# EAGLE design Sphagnum_mom_rev_a (EAGLE 9.6.2)
AUTOR: Renato; CODIGO: 0; DESENHO: Renato; EQUIPAMENTO: Alimentador Caes e Gatos; MODELO: JM01; REV: A
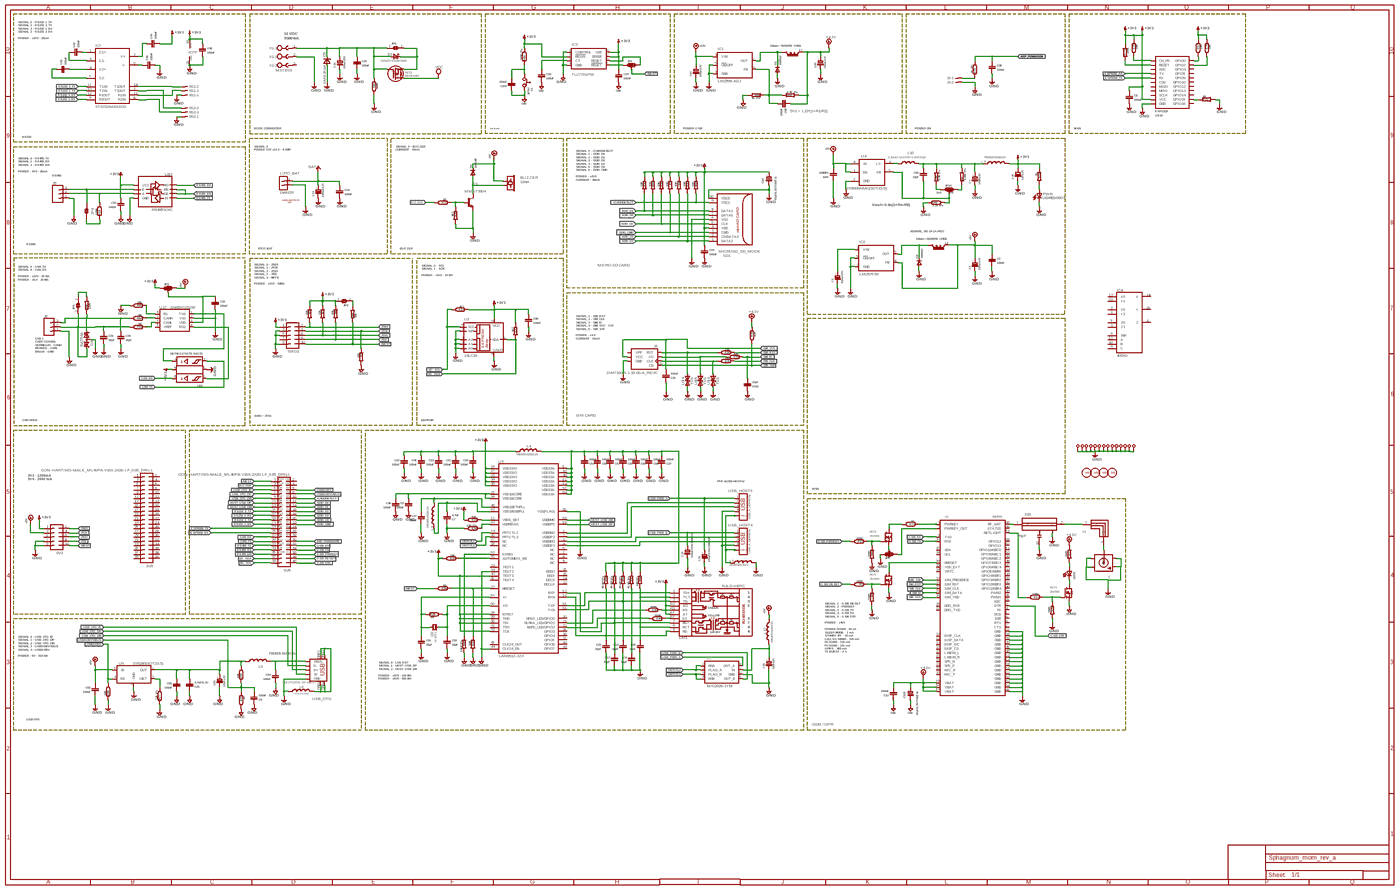
[diagram p0: schematic, sheet 1, overview]
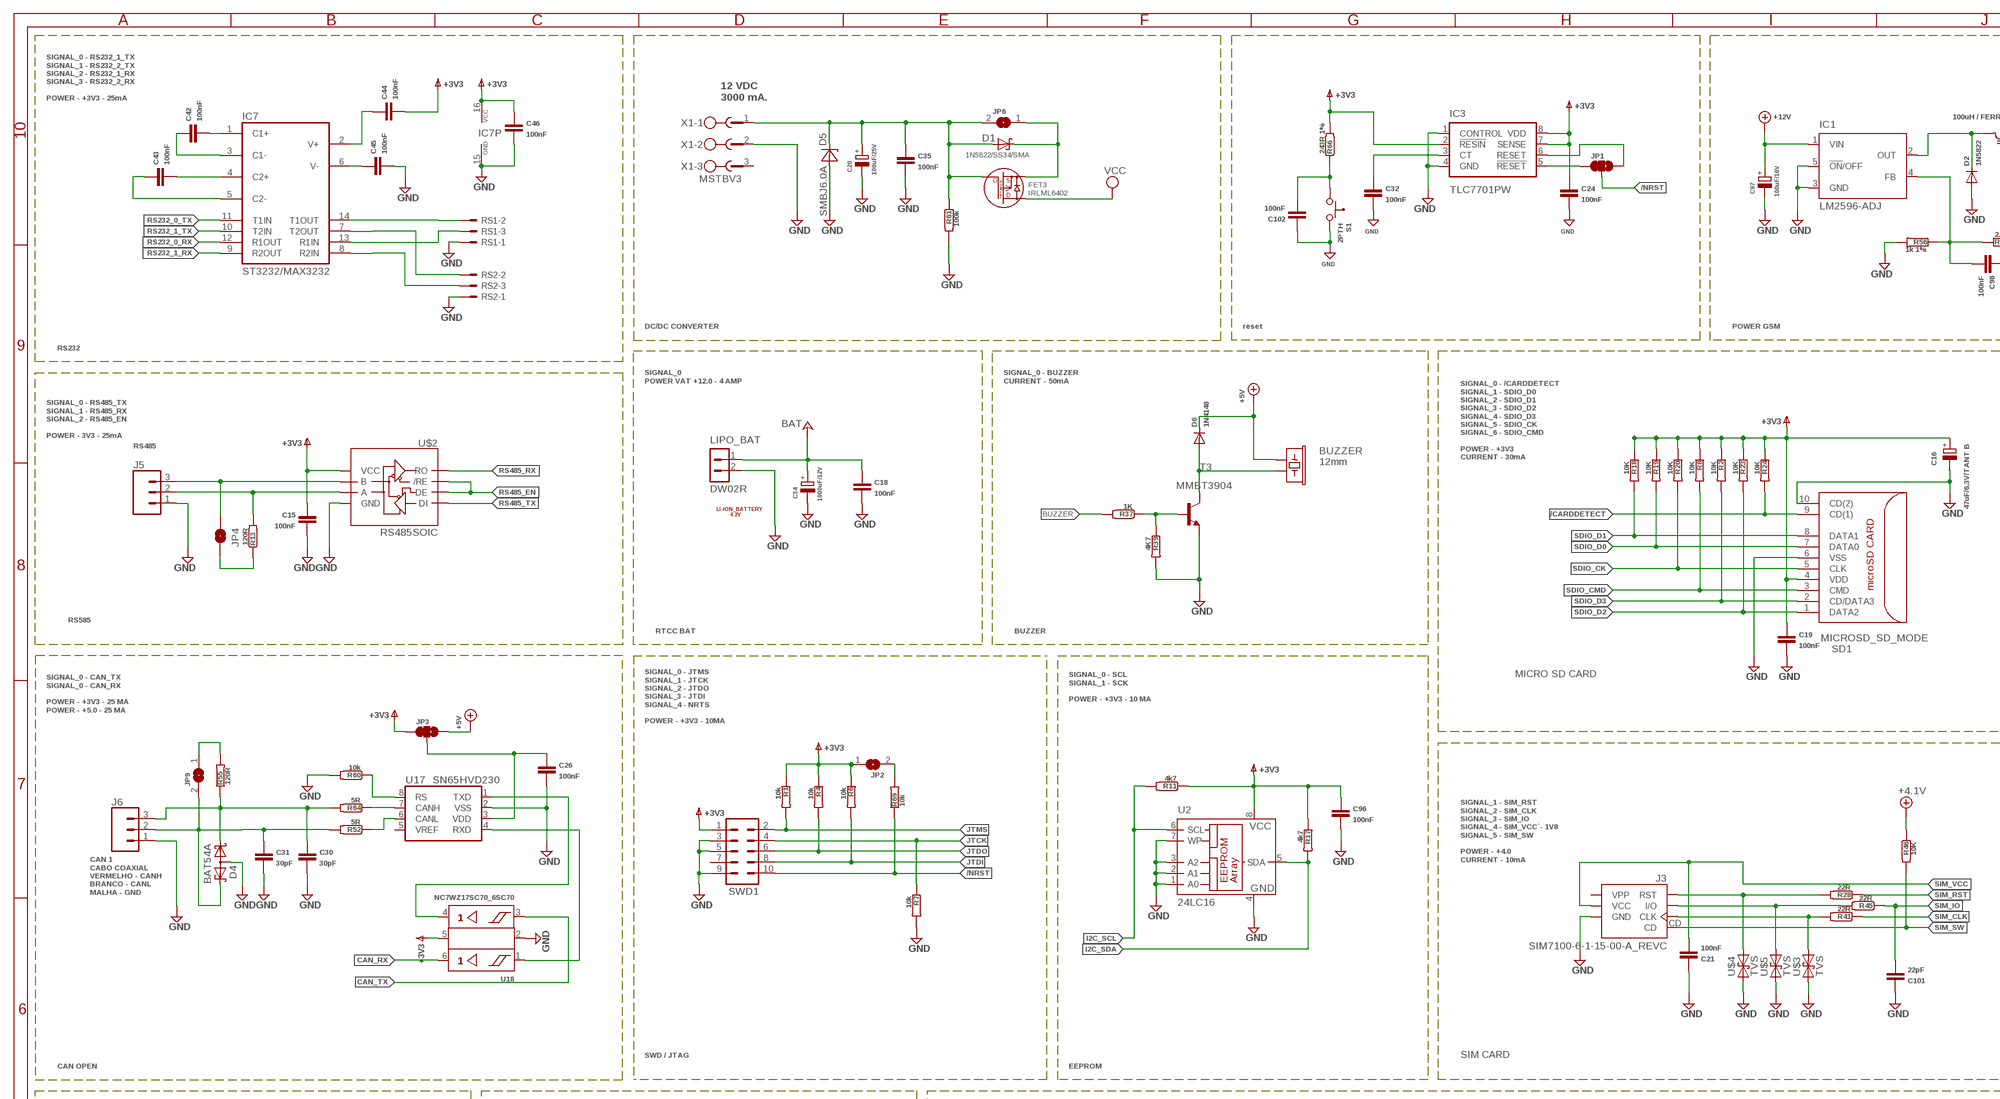
[diagram p1: schematic, sheet 1, part 1 of 4]
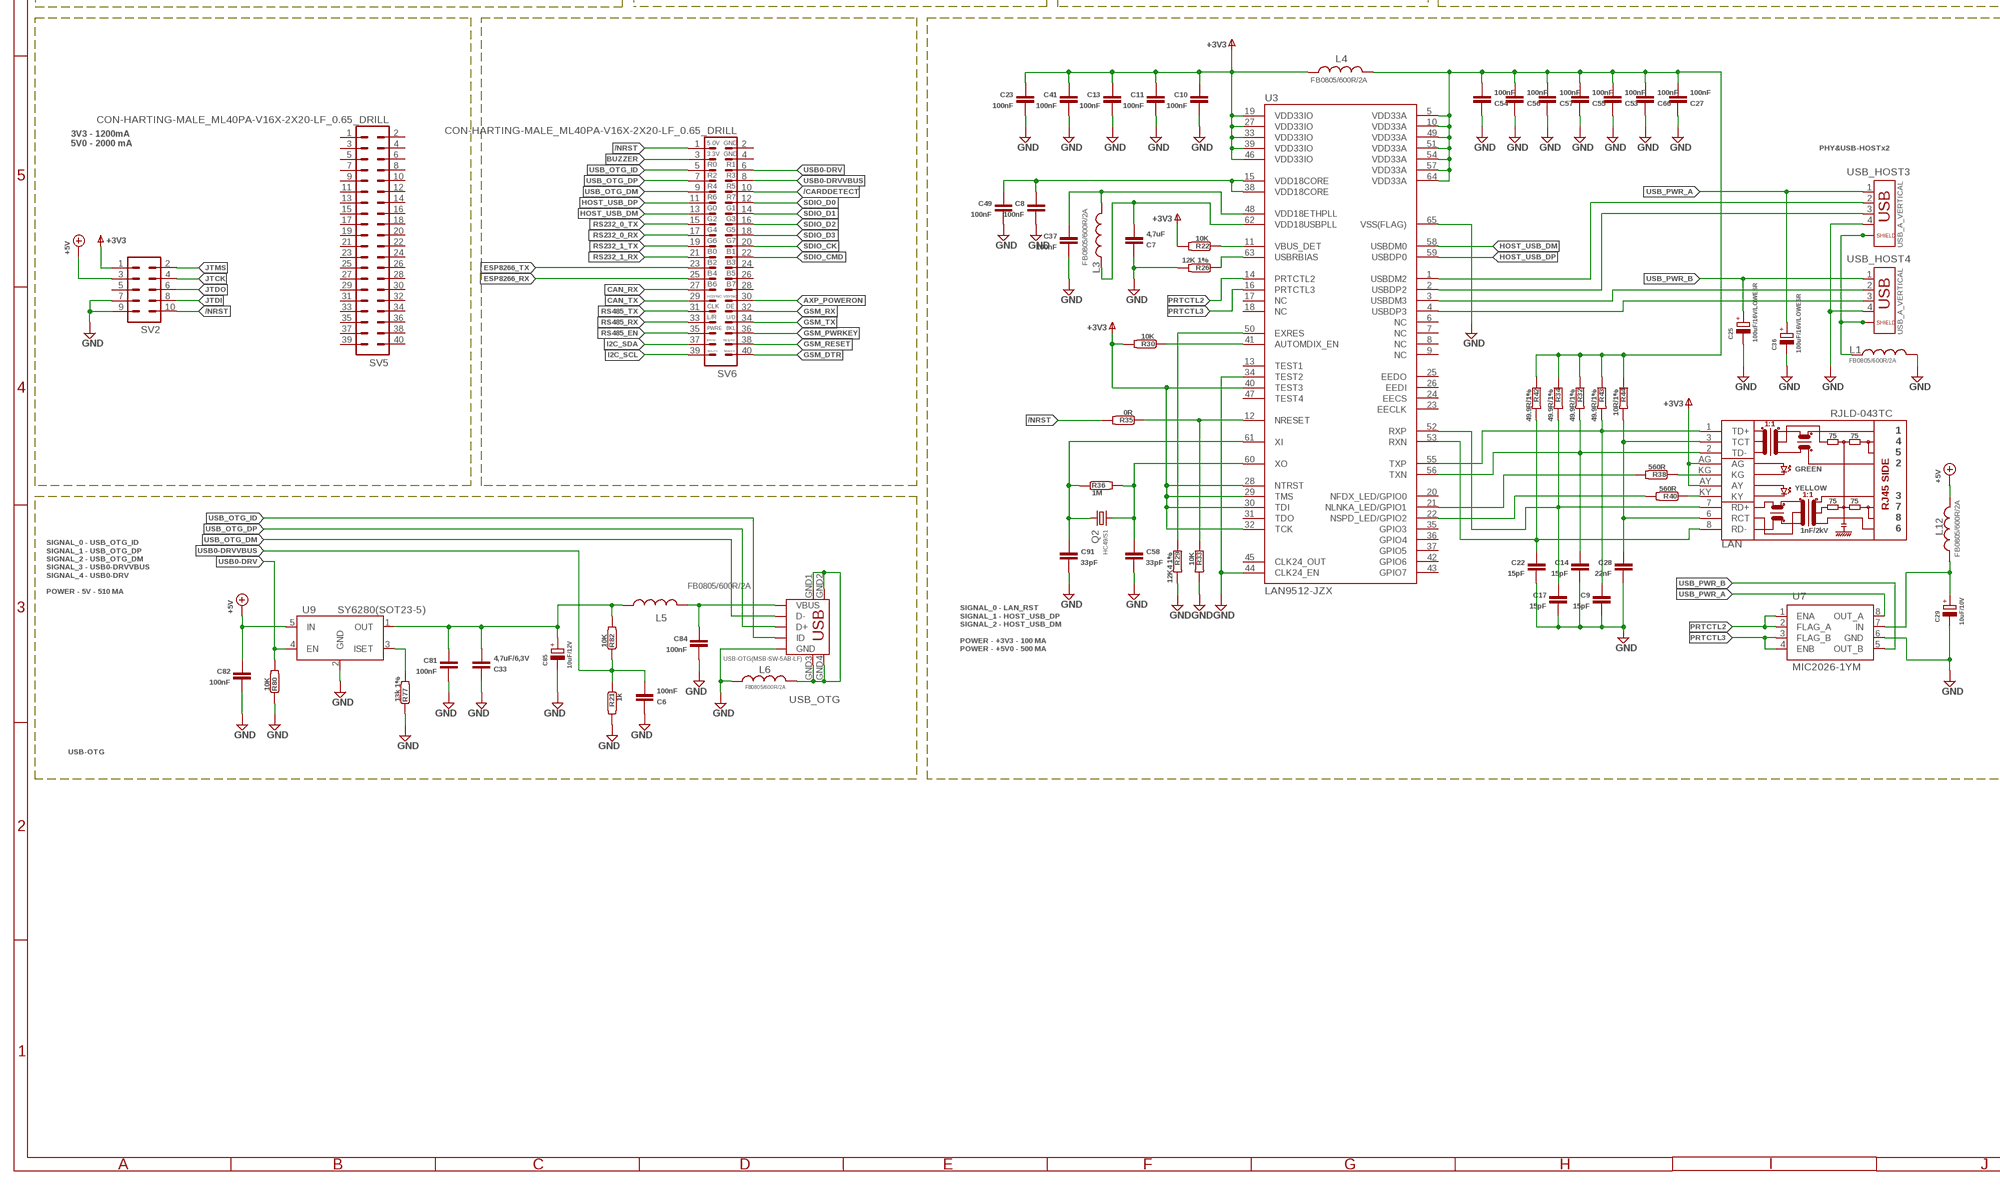
[diagram p2: schematic, sheet 1, part 2 of 4]
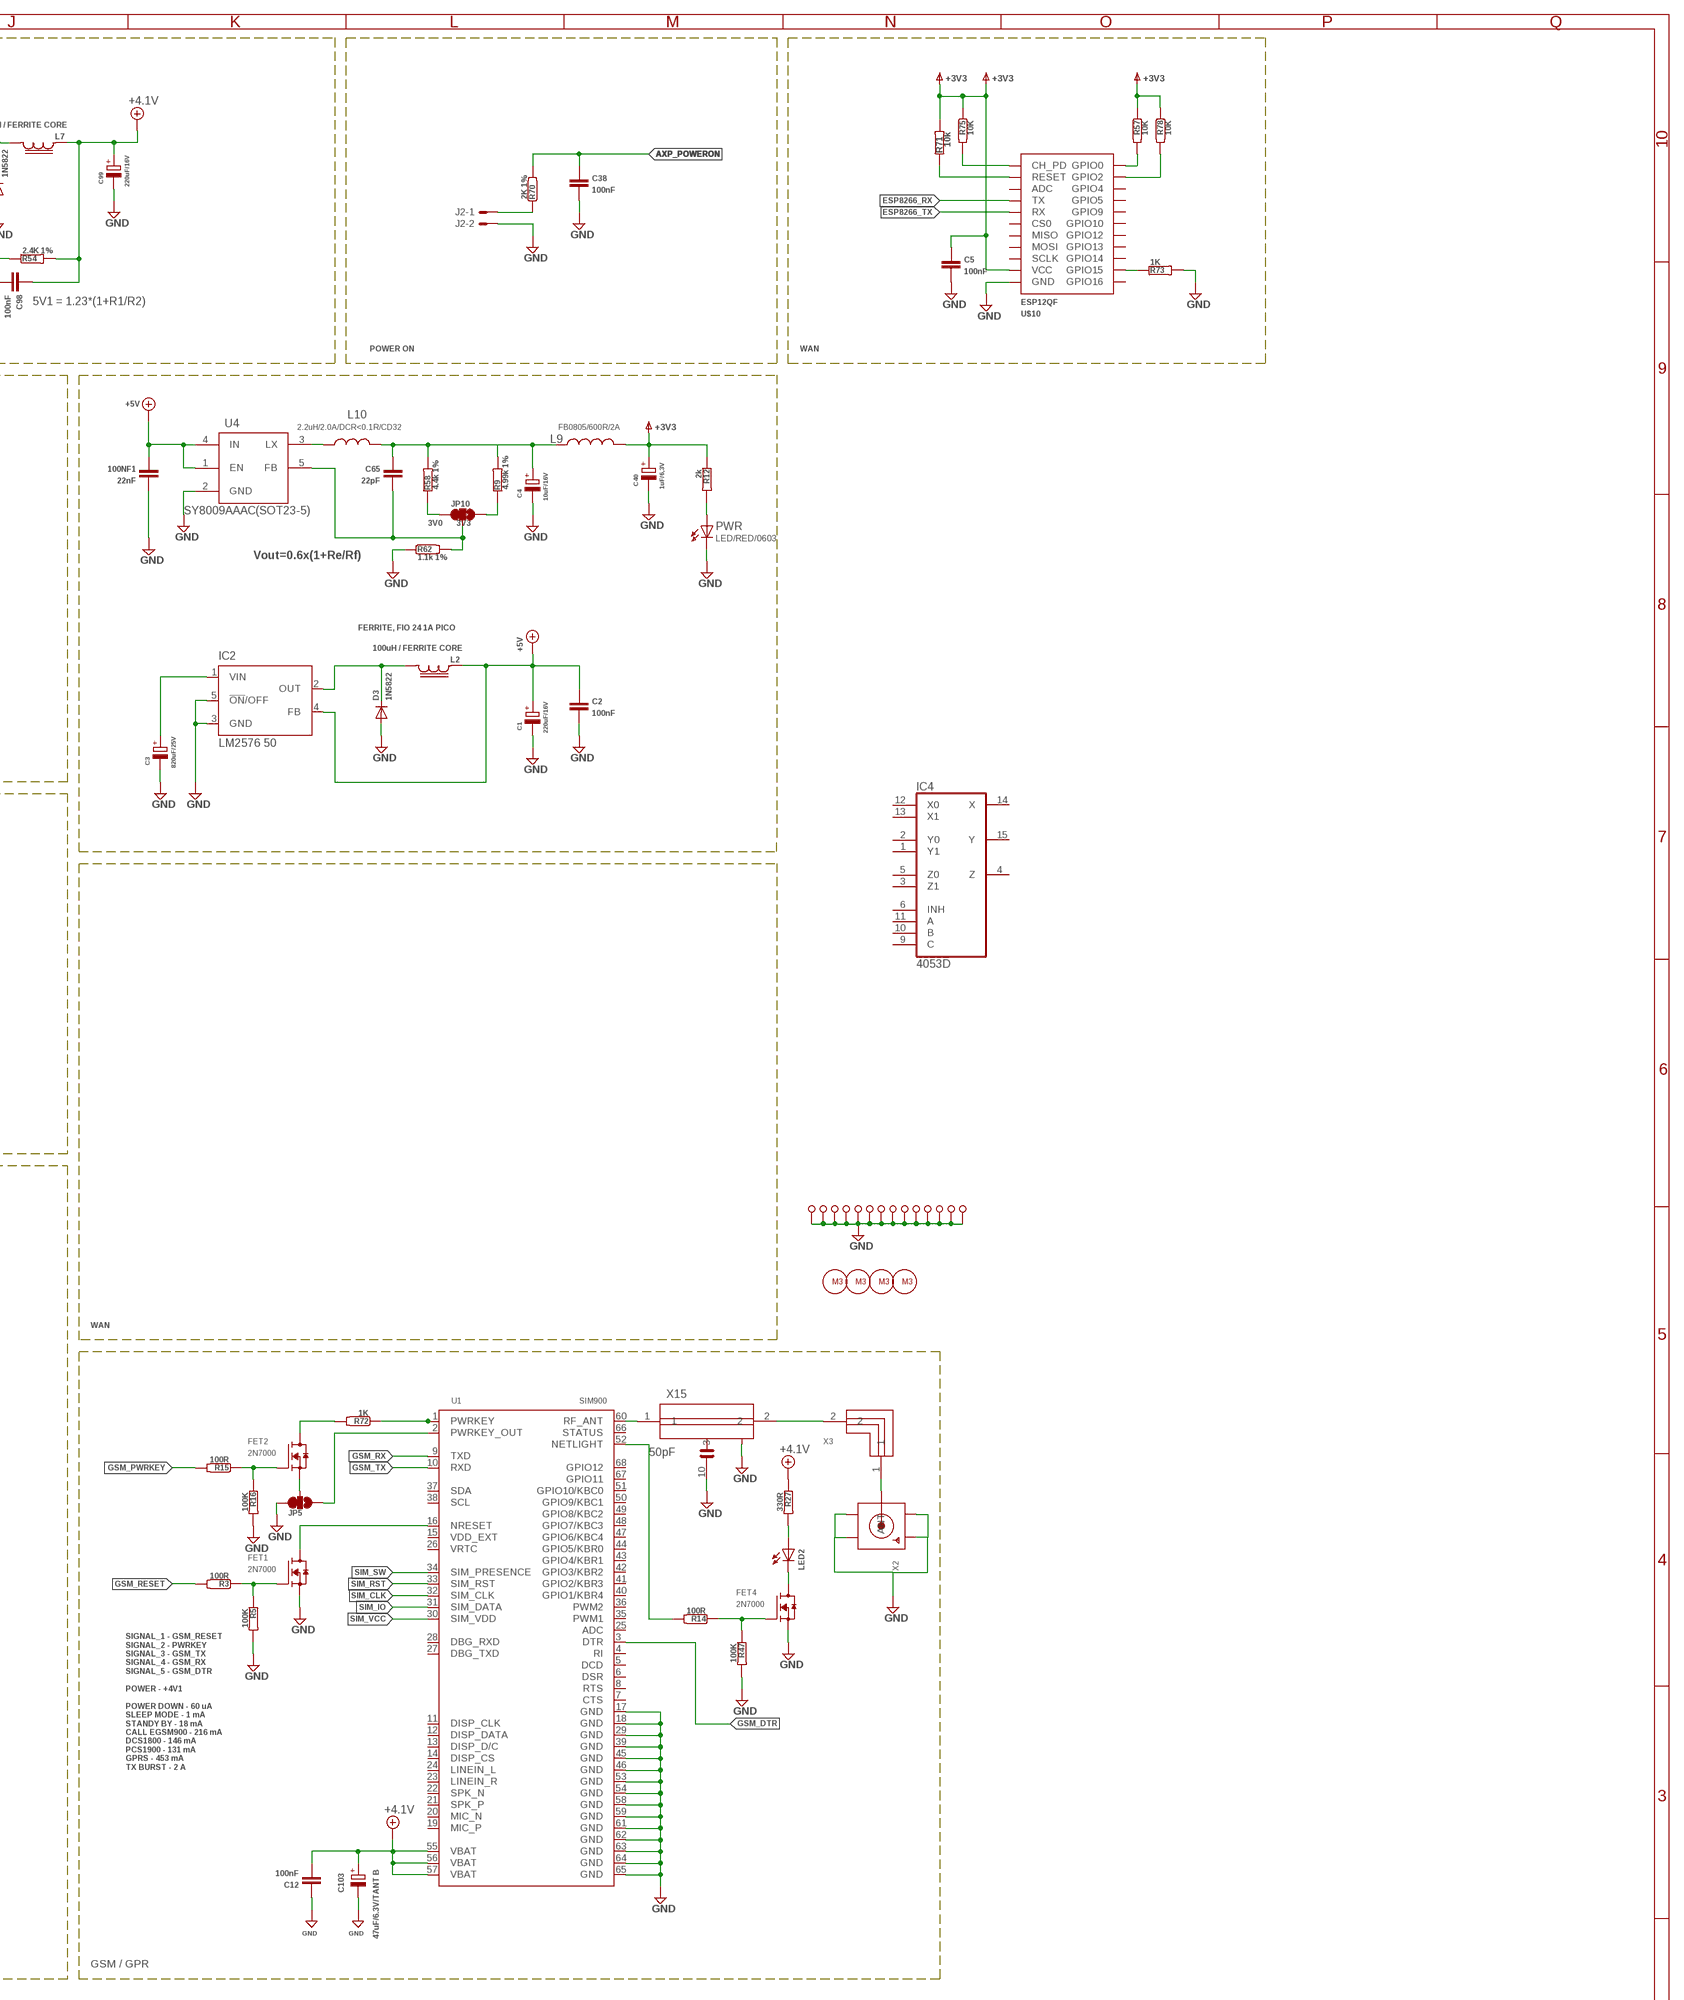
[diagram p3: schematic, sheet 1, part 3 of 4]
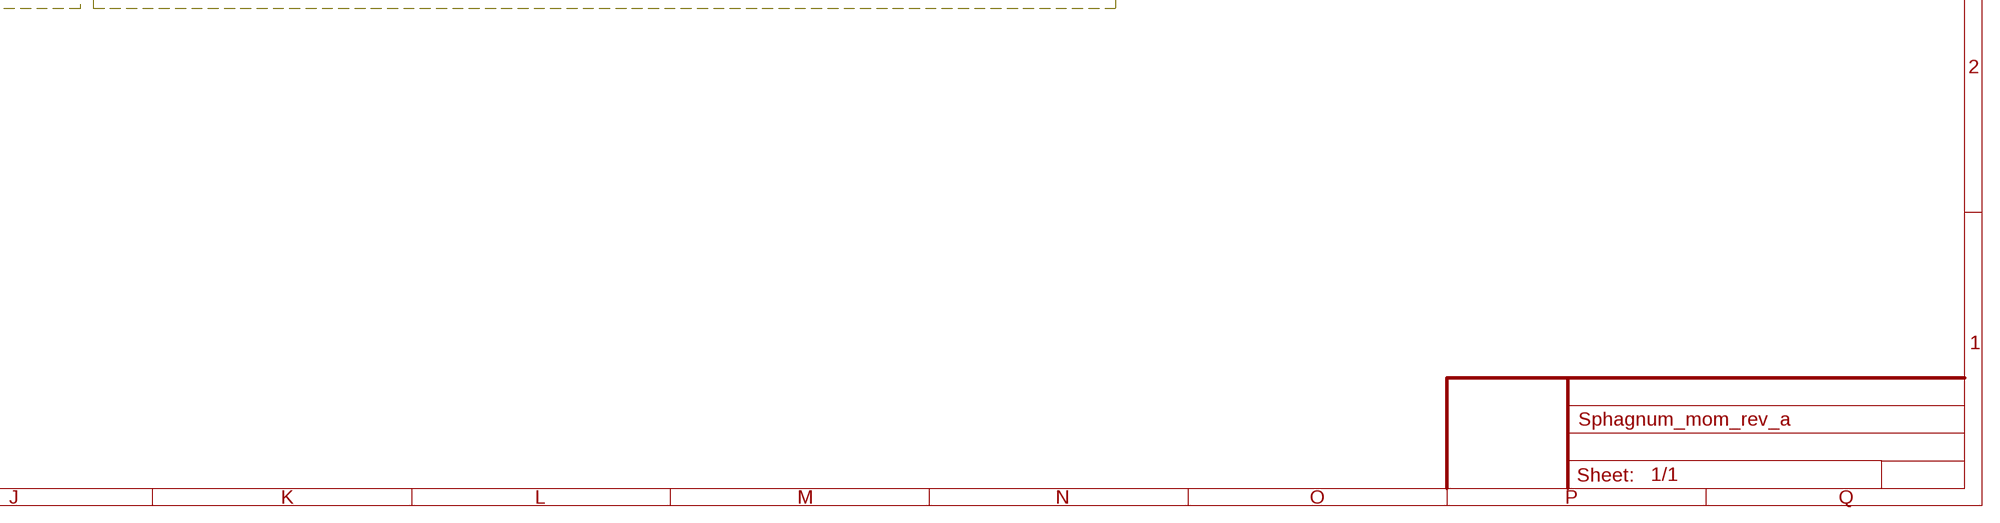
[diagram p4: schematic, sheet 1, part 4 of 4]

## Parts
100NF1  22nF  C-EUC0603  [C0603]
BUZZER  12mm  BUZZERPTH  [BUZZER-12MM]
C1  220uF/16V  CPOL-EUE3.5-8  [E3,5-8]
C2  100nF  C-EUC0603  [C0603]
C3  820uF/25V  CPOL-EUE3.5-10  [E3,5-10]
C4  10uF/16V  CPOL-EUB  [PANASONIC_B]
C5  100nF  C-EUC0603  [C0603]
C6  100nF  C-EUC0603  [C0603]
C7  4,7uF  C-EUC0603  [C0603]
C8  100nF  C-EUC0603  [C0603]
C9  15pF  C-EUC0603  [C0603]
C10  100nF  C-EUC0603  [C0603]
C11  100nF  C-EUC0603  [C0603]
C12  100nF  C-EUC0603  [C0603]
C13  100nF  C-EUC0603  [C0603]
C14  15pF  C-EUC0603  [C0603]
C15  100nF  C-EUC0603  [C0603]
C16  47uF/6.3V/TANT B  CPOL-EUA/3216-18R  [A/3216-18R]
C17  15pF  C-EUC0603  [C0603]
C18  100nF  C-EUC0603  [C0603]
C19  100nF  C-EUC0603  [C0603]
C20  100uF/25V  CPOL-EUE3.5-8  [E3,5-8]
C21  100nF  C-EUC0603  [C0603]
C22  15pF  C-EUC0603  [C0603]
C23  100nF  C-EUC0603  [C0603]
C24  100nF  C-EUC0603  [C0603]
C25  100uF/16V/LOWESR  CPOL-EUD  [PANASONIC_D]
C26  100nF  C-EUC0603  [C0603]
C27  100nF  C-EUC0603  [C0603]
C28  22nF  C-EUC0603  [C0603]
C29  10uF/10V  CPOL-EUB  [PANASONIC_B]
C30  30pF  C-EUC0603  [C0603]
C31  30pF  C-EUC0603  [C0603]
C32  100nF  C-EUC0603  [C0603]
C33  4,7uF/6,3V  C-EUC0603  [C0603]
C34  1000uF/12V  CPOL-EUD  [PANASONIC_D]
C35  100nF  C-EUC0603  [C0603]
C36  100uF/16V/LOWESR  CPOL-EUD  [PANASONIC_D]
C37  100nF  C-EUC0603  [C0603]
C38  100nF  C-EUC0603  [C0603]
C40  1uF/6,3V  CPOL-EUA  [PANASONIC_A]
C41  100nF  C-EUC0603  [C0603]
C42  100nF  C-EUC0603  [C0603]
C43  100nF  C-EUC0603  [C0603]
C44  100nF  C-EUC0603  [C0603]
C45  100nF  C-EUC0603  [C0603]
C46  100nF  C-EUC0603  [C0603]
C49  100nF  C-EUC0603  [C0603]
C53  100nF  C-EUC0603  [C0603]
C54  100nF  C-EUC0603  [C0603]
C55  100nF  C-EUC0603  [C0603]
C56  100nF  C-EUC0603  [C0603]
C57  100nF  C-EUC0603  [C0603]
C58  33pF  C-EUC0603  [C0603]
C65  22pF  C-EUC0603  [C0603]
C66  100nF  C-EUC0603  [C0603]
C81  100nF  C-EUC0603  [C0603]
C82  100nF  C-EUC0603  [C0603]
C84  100nF  C-EUC0603  [C0603]
C85  10uF/12V  CPOL-EUA  [PANASONIC_A]
C91  33pF  C-EUC0603  [C0603]
C96  100nF  C-EUC0603  [C0603]
C97  100uF/16V  CPOL-EUE3.5-8  [E3,5-8]
C98  100nF  C-EUC0603  [C0603]
C99  220uF/16V  CPOL-EUE3.5-8  [E3,5-8]
C101  22pF  C-EUC0603  [C0603]
C102  100nF  C-EUC0603  [C0603]
C103  47uF/6.3V/TANT B  CPOL-EUA/3216-18R  [A/3216-18R]
D1  1N5822/SS34/SMA  SCHOTKKY7.62SS2  [MLL-41]
D2  1N5822  DIODESMA  [SMA-DIODE]
D3  1N5822  DIODESMA  [SMA-DIODE]
D4  BAT54A  [SOT23]
D5  SMBJ6.0A  SMBJ16A  [DO214AA]
D6  1N4148  DIODESMA  [SMA-DIODE]
FET1  2N7000  [SOT23]
FET2  2N7000  [SOT23]
FET3  IRLML6402  P-MOS+DIODIRLML6402  [SOT23]
FET4  2N7000  [SOT23]
HL1  M3  [M3]
HL2  M3  [M3]
HL3  M3  [M3]
HL4  M3  [M3]
IC1  LM2596-ADJ  LM2596S  [TO263-5]
IC2  LM2576 50  LM2596S  [TO263-5]
IC3  TLC7701PW  [PW_R-PDSO-G08]
IC4  4053D  [SO16]
IC7  ST3232/MAX3232  MAX3232CSE  [SO16]
J2  22-27-2021-02  [6410-02]
J3  SIM7100-6-1-15-00-A_REVC  [GCT_SIM7100-6-1-15-00-A_REVC]
J5  CONN_03JST-PTH-VERT  [JST-3-PTH-VERT]
J6  CONN_03JST-PTH-VERT  [JST-3-PTH-VERT]
JP1  JUMPER_3  [JUMPER_3_SMD]
JP2  JUMPER_2_NO  [JUMPER_2_NO]
JP3  JUMPER_3  [JUMPER_3_SMD]
JP4  JUMPER-SMT_2_NO_SILK  [SMT-JUMPER_2_NO_SILK]
JP5  JUMPER_3  [JUMPER_3_SMD]
JP6  JUMPER_2_NO  [JUMPER_2_NO]
JP9  JUMPER_2_NO  [JUMPER_2_NO]
JP10  JUMPER_3  [JUMPER_3_SMD]
L1  FB0805/600R/2A  L-US0204/5  [0204/5]
L2  100uH / FERRITE CORE  INDUTOR  [INDUTOR]
L3  FB0805/600R/2A  L-USL1812  [L1812]
L4  FB0805/600R/2A  L-USL1812  [L1812]
L5  FB0805/600R/2A  L-US0204/5  [0204/5]
L6  FB0805/600R/2A  L-US0204/5  [0204/5]
L7  100uH / FERRITE CORE  INDUTOR  [INDUTOR]
L9  FB0805/600R/2A  L-USL1812  [L1812]
L10  2.2uH/2.0A/DCR<0.1R/CD32  L-CD32  [CD32]
L12  FB0805/600R/2A  L-USL1812  [L1812]
LAN  RJLD-043TC  [RJLD-043TC_PACK]
LED2  LED0603  [LED-0603]
LIPO_BAT  DW02R  CON2DW02R  [DW02R]
P1  PADP  [PAD]
P2  PADP  [PAD]
P3  PADP  [PAD]
P5  PADP  [PAD]
P7  PADP  [PAD]
P9  PADP  [PAD]
P10  PADP  [PAD]
P11  PADP  [PAD]
P12  PADP  [PAD]
P14  PADP  [PAD]
P15  PADP  [PAD]
P16  PADP  [PAD]
P17  PADP  [PAD]
P18  PADP  [PAD]
PWR  LED/RED/0603  LED0805DWS  [LED-0805]
Q2  HC49/S1  [HC49/SMD2_THIN]
R1  10k  R-EU_R0603  [R0603]
R2  10K  R-EU_R0603  [R0603]
R3  100R  R-EU_R0603  [R0603]
R4  10k  R-EU_R0603  [R0603]
R5  100K  R-EU_R0603  [R0603]
R6  10k  R-EU_R0603  [R0603]
R7  10k  R-EU_R0603  [R0603]
R8  10K  R-EU_R0603  [R0603]
R9  4.99k 1%  R-EU_R0603  [R0603]
R11  4k7  R-EU_R0603  [R0603]
R12  2k  R-EU_R0603  [R0603]
R13  120R  R-EU_R0603  [R0603]
R14  100R  R-EU_R0603  [R0603]
R15  100R  R-EU_R0603  [R0603]
R16  100K  R-EU_R0603  [R0603]
R17  4k7  R-EU_R0603  [R0603]
R18  10K  R-EU_R0603  [R0603]
R19  10K  R-EU_R0603  [R0603]
R20  10K  R-EU_R0603  [R0603]
R21  1k  R-EU_R0603  [R0603]
R22  10K  R-EU_R0603  [R0603]
R23  10K  R-EU_R0603  [R0603]
R24  10K  R-EU_R0603  [R0603]
R26  12K 1%  R-EU_R0603  [R0603]
R27  330R  R-EU_R0603  [R0603]
R28  22R  R-EU_R0603  [R0603]
R29  12K4 1%  R-EU_R0603  [R0603]
R30  10K  R-EU_R0603  [R0603]
R32  49.9R/1%  R-EU_R0603  [R0603]
R33  10K  R-EU_R0603  [R0603]
R34  49.9R/1%  R-EU_R0603  [R0603]
R35  0R  R-EU_R0603  [R0603]
R36  1M  R-EU_R0603  [R0603]
R37  1K  R-EU_R0603  [R0603]
R38  560R  R-EU_R0603  [R0603]
R39  4K7  R-EU_R0603  [R0603]
R40  560R  R-EU_R0603  [R0603]
R41  22R  R-EU_R0603  [R0603]
R42  49.9R/1%  R-EU_R0603  [R0603]
R43  49.9R/1%  R-EU_R0603  [R0603]
R44  10R/1%  R-EU_R0603  [R0603]
R45  22R  R-EU_R0603  [R0603]
R46  10K  R-EU_R0603  [R0603]
R47  100K  R-EU_R0603  [R0603]
R52  5R  R-EU_R0603  [R0603]
R54  2.4K 1%  R-EU_R0603  [R0603]
R55  120R  R-EU_R0603  [R0603]
R56  1k 1%  R-EU_R0603  [R0603]
R57  10K  R-EU_R0603  [R0603]
R58  4.4k 1%  R-EU_R0603  [R0603]
R60  10k  R-EU_R0603  [R0603]
R61  100k  R-EU_R0603  [R0603]
R62  1.1k 1%  R-EU_R0603  [R0603]
R64  5R  R-EU_R0603  [R0603]
R66  243R 1%  R-EU_R0603  [R0603]
R69  10k  R-EU_R0603  [R0603]
R70  2K 1%  R-EU_R0603  [R0603]
R71  10k  R-EU_R0603  [R0603]
R72  1K  R-EU_R0603  [R0603]
R73  1K  R-EU_R0603  [R0603]
R75  10K  R-EU_R0603  [R0603]
R77  13k 1%  R-EU_R0603  [R0603]
R78  10K  R-EU_R0603  [R0603]
R80  10K  R-EU_R0603  [R0603]
R82  10K  R-EU_R0603  [R0603]
RS1  22-27-2031-03  [6410-03]
RS2  22-27-2031-03  [6410-03]
S1  2PTH  SWITCH-MOMENTARY-2PTH  [TACTILE-PTH]
SD1  MICROSD_SD_MODE  [MICRO_SD_CONNECTOR]
SV2  ML10  [ML10]
SV5  CON-HARTING-MALE_ML40PA-V16X-2X20-LF_0.65_DRILL  CON-HARTING-ML_ML40PA-V16X-2X20-LF_0.65_DRILL  [CON-HARTING-ML_PA-V16X-2X20-LF_0.65_DRILL]
SV6  CON-HARTING-MALE_ML40PA-V16X-2X20-LF_0.65_DRILL  CON-HARTING-ML_ML40PA-V16X-2X20-LF_0.65_DRILL  [CON-HARTING-ML_PA-V16X-2X20-LF_0.65_DRILL]
SWD1  MA05-2  [MA05-2]
T3  MMBT3904  MMBT3904LT1-NPN-SOT23-BEC  [SOT23-BEC]
U1  SIM900  SMD-GPRS-MODULE-SIM900(LGA68)  [LGA68-1.0-24.0X24.0X3.0MM]
U2  24LC16  24LC025SN  [SO-08]
U3  LAN9512-JZX  [QFN64]
U4  SY8009AAAC(SOT23-5)  SY8008  [SOT23-5@2]
U7  MIC2026-1YM  [SO-8]
U9  SY6280(SOT23-5)  SY6280  [SOT23-5]
U17  SN65HVD230  MCP2551-I/SN  [SO-08_THIN]
U18  NC7WZ17SC70_6SC70  [SC70-6]
U$2  RS485SOIC  [SO08]
U$3  TVS  [SMA-DIODE]
U$4  TVS  [SMA-DIODE]
U$5  TVS  [SMA-DIODE]
U$10  ESP12QF  [ESP8266F]
USB_HOST3  USB_A_VERTICAL  USB_SHIELDUSB_A_VERTICAL  [USB_A_VERTICAL_PTH]
USB_HOST4  USB_A_VERTICAL  USB_SHIELDUSB_A_VERTICAL  [USB_A_VERTICAL_PTH]
USB_OTG  USB-OTG(MSB-SW-5AB-LF)  MINI_USB9-USB-OTG(MSB-SW-5AB-LF)  [USB_MINI_9PIN-SD]
X1  MSTBV3  [MSTBV3]
X2  SMACONNECTOR  [SMA90_DIP]
X3  CHIPDESIGN_GCPW_50_OHM_L  [GCPW_50_OHM_LEFT]
X15  50pF  CHIPDESIGN_GCPW_50_OHM_SHUNT_0402  [GCPW_50_OHM_0402_SHUNT]

## Nets
+3V3 [pwr]: C5.1 C10.1 C11.1 C13.1 C15.1 C16.+ C19.1 C23.1 C24.1 C40.+ C41.1 C44.2 C46.1 C96.1 IC3.2(!RESIN) IC3.7(SENSE) IC3.8(VDD) IC7.16(VCC) JP2.1 JP3.1 L4.1 L9.2 LAN.AG LAN.AY R1.1 R2.1 R4.1 R6.1 R8.1 R11.1 R12.1 R17.1 R18.1 R19.1 R20.1 R22.2 R23.1 R24.1 R30.2 R57.1 R66.2 R71.2 R75.1 R78.1 SD1.4(VDD) SV2.1 SWD1.1 U2.8(VCC) U3.19(VDD33IO) U3.27(VDD33IO) U3.28(NTRST) U3.29(TMS) U3.30(TDI) U3.32(TCK) U3.33(VDD33IO) U3.39(VDD33IO) U3.40(TEST3) U3.46(VDD33IO) U18.5(VCC) U$2.8(VCC) U$10.VCC
+4.1V: C12.2 C98.1 C99.+ C103.+ L7.P$1 R27.1 R46.1 R54.2 U1.55(VBAT) U1.56(VBAT) U1.57(VBAT)
+5V [pwr]: 100NF1.1 BUZZER.+ C1.+ C2.1 C82.1 D6.C IC2.4(FB) JP3.3 L2.P$1 L12.2 SV2.3 U4.1(EN) U4.4(IN) U9.5(IN)
+12V [pwr]: C97.+ IC1.1(VIN)
+24V: C18.1 C34.+ LIPO_BAT.1 ; supply symbol labelled BAT
/CARDDETECT: R24.2 SD1.9(CD(1)) SV6.10
/NRST: JP1.2 R35.2 R69.1 SV2.10 SV6.1 SWD1.10
AXP_POWERON: C38.1 R70.2 SV6.30
BUZZER: R37.2 SV6.3
CAN_RX: SV6.27 U18.6
CAN_TX: SV6.29 U18.3
CANH: C31.1 D4.2(K2) J6.2 JP9.2 R52.2
CANH2: J5.3 JP4.2 U$2.7(B)
ESP8266_RX: SV6.25 U$10.TX
ESP8266_TX: SV6.23 U$10.RX
GND: 100NF1.2 C1.- C2.2 C3.- C4.- C5.2 C6.1 C7.1 C8.2 C9.2 C10.2 C11.2 C12.1 C13.2 C14.2 C15.2 C16.- C17.2 C18.2 C19.2 C20.- C21.1 C22.2 C23.2 C24.2 C25.- C26.2 C27.1 C28.2 C29.- C30.2 C31.2 C32.2 C33.1 C34.- C35.2 C36.- C37.2 C38.2 C40.- C41.2 C45.2 C46.2 C49.2 C53.1 C54.1 C55.1 C56.1 C57.1 C58.2 C66.1 C81.2 C82.2 C84.2 C85.- C91.2 C96.2 C97.- C99.- C101.1 C102.1 C103.- D2.A D3.A D4.3(AA) D5.A FET1.2(S) FET4.2(S) IC1.3(GND) IC1.5(!ON!/OFF) IC2.3(GND) IC2.5(!ON!/OFF) IC3.1(CONTROL) IC3.4(GND) IC7.15(GND) J2.2 J3.C5(GND) J5.1 J6.1 JP5.1 L1.2 L6.1 LIPO_BAT.2 P1.A P2.A P3.A P5.A P7.A P9.A P10.A P11.A P12.A P14.A P15.A P16.A P17.A P18.A PWR.C R5.2 R7.2 R16.2 R21.2 R26.2 R29.2 R33.2 R39.2 R47.2 R56.2 R60.2 R61.2 R62.1 R73.2 R77.1 R80.1 RS1.1 RS2.1 S1.3 SD1.6(VSS) SD1.10(CD(2)) SV2.7 SV2.9 SWD1.3 SWD1.5 SWD1.9 T3.E U1.17(GND) U1.18(GND) U1.29(GND) U1.39(GND) U1.45(GND) U1.46(GND) U1.53(GND) U1.54(GND) U1.58(GND) U1.59(GND) U1.61(GND) U1.62(GND) U1.63(GND) U1.64(GND) U1.65(GND) U2.1(A0) U2.2(A1) U2.3(A2) U2.4(GND) U2.7(WP) U3.34(TEST2) U3.44(CLK24_EN) U3.65(VSS(FLAG)) U4.2(GND) U7.6(GND) U9.2(GND) U17.2(VSS) U18.2(GND) U$2.5(GND) U$3.A U$4.A U$5.A U$10.GND USB_HOST3.4 USB_HOST4.4 USB_OTG.GND X1.2 X2.GND1 X2.GND2 X2.GND3 X2.GND4 X15.3(GND) X15.4(GND) X15.5(GND) X15.6(GND) X15.7(GND) X15.8(GND) X15.9(GND) X15.10 X15.11(GND) X15.12(GND)
GSM_DTR: SV6.40 U1.3(DTR)
GSM_PWRKEY: R15.2 SV6.36
GSM_RESET: R3.2 SV6.38
GSM_RX: SV6.32 U1.9(TXD)
GSM_TX: SV6.34 U1.10(RXD)
HOST_USB_DM: SV6.13 U3.58(USBDM0)
HOST_USB_DP: SV6.11 U3.59(USBDP0)
I2C_SCL: R11.2 SV6.39 U2.6(SCL)
I2C_SDA: R17.2 SV6.37 U2.5(SDA)
JTCK: R7.1 SV2.4 SWD1.4
JTDI: R6.2 SV2.8 SWD1.8
JTDO: R4.2 SV2.6 SWD1.6
JTMS: R1.2 SV2.2 SWD1.2
N$1: PWR.A R12.2
N$2: R60.1 U17.8(RS)
N$3: C37.1 L3.2 U3.48(VDD18ETHPLL)
N$4: R77.2 U9.3(ISET)
N$5: C29.+ L12.1 U7.7(IN)
N$6: IC3.5(!RESET) JP1.1
N$7: J2.1 R70.1
N$8: C7.2 L3.1 U3.62(VDD18USBPLL)
N$9: L1.1 USB_HOST3.P$3 USB_HOST3.P$4 USB_HOST4.P$3 USB_HOST4.P$4
N$10: U3.2(USBDP2) USB_HOST3.3
N$11: U3.3(USBDM3) USB_HOST4.2
N$12: U3.4(USBDP3) USB_HOST4.3
N$13: FET1.1(G) R3.1 R5.1
N$14: BUZZER.- D6.A T3.C
N$15: R14.2 U1.52(NETLIGHT)
N$16: R37.1 R39.1 T3.B
N$17: JP2.2 R69.2
N$18 [pwr]: D2.C IC1.2(OUT) L7.P$2
N$19: FET4.3(D) LED2.C
N$20: JP4.1 R13.1
N$21: C30.1 D4.1(K1) J6.3 R55.1 R64.2
N$22: JP9.1 R55.2
N$23: FET1.3(D) U1.16(NRESET)
N$24: IC7.7(T2OUT) RS2.2
N$25: IC7.8(R2IN) RS2.3
N$26: LED2.A R27.2
N$27: FET2.3(D) R72.2
N$28: FET2.1(G) R15.1 R16.1
N$29: U1.60(RF_ANT) X15.1
N$30: J3.C2(RST) R28.2 U$4.C
N$31: X3.2 X15.2
N$32: C20.+ C35.1 D1.A D5.C FET3.1(G) JP6.2 R61.1 X1.1
N$33 [pwr]: D1.K(C) FET3.2(S) JP6.1
N$35: R71.1 U$10.RST(RESET)
N$36: FET4.1(G) R14.1 R47.1
N$37: J3.C7(I/O) R45.2 U$5.C
N$38: FET2.2(S) JP5.2
N$39: C8.1 C49.1 U3.15(VDD18CORE) U3.38(VDD18CORE)
N$40: J3.C3(CLK) R41.2 U$3.C
N$41: R75.2 U$10.EN(CH_PD)
N$42: R26.1 U3.63(USBRBIAS)
N$43: R29.1 U3.50(EXRES)
N$44: R30.1 U3.41(AUTOMDIX_EN)
N$45: C91.1 Q2.2 R36.1 U3.61(XI)
N$46: C58.1 Q2.1 R36.2 U3.60(XO)
N$47: R78.2 U$10.GPIO2
N$48: R38.2 U3.21(NLNKA_LED/GPIO1)
N$49: R40.2 U3.22(NSPD_LED/GPIO2)
N$50: LAN.KG R38.1
N$51: LAN.KY R40.1
N$52: C22.1 LAN.8(RD-) R42.2 U3.53(RXN)
N$53: R73.1 U$10.GPIO15
N$54: C17.1 LAN.7(RD+) R34.2 U3.52(RXP)
N$55: C14.1 LAN.2(TD-) R32.2 U3.56(TXN)
N$56: C9.1 LAN.1(TD+) R43.2 U3.55(TXP)
N$57: R57.2 U$10.GPIO0
N$58: C28.1 LAN.3(TCT) LAN.6(RCT) R44.2
N$59: U3.1(USBDM2) USB_HOST3.2
N$60: R72.1 U1.1(PWRKEY)
N$61: JP5.3 U1.2(PWRKEY_OUT)
N$62 [pwr]: C3.+ IC2.1(VIN)
N$63: X2.ANTENNA(ANT) X3.1
N$64: R33.1 R35.1 U3.12(NRESET)
N$65: C65.2 JP10.2 R62.2 U4.5(FB)
N$66: JP10.1 R58.1
N$67: JP10.3 R9.1
N$68 [pwr]: C4.+ C65.1 L9.1 L10.2 R9.2 R58.2
N$69: C32.1 IC3.3(CT)
N$70 [pwr]: D3.C IC2.2(OUT) L2.P$2
N$71: IC3.6(RESET) JP1.3
N$75: L10.1 U4.3(LX)
N$77: C27.2 C53.2 C54.2 C55.2 C56.2 C57.2 C66.2 L4.2 R32.1 R34.1 R42.1 R43.1 R44.1 U3.5(VDD33A) U3.10(VDD33A) U3.49(VDD33A) U3.51(VDD33A) U3.54(VDD33A) U3.57(VDD33A) U3.64(VDD33A)
N$78: R22.1 U3.11(VBUS_DET)
N$81: C33.2 C81.1 C85.+ L5.2 R82.2 U9.1(OUT)
N$84: J5.2 R13.2 U$2.6(A)
N$85 [pwr]: C26.1 JP3.2 U17.3(VDD)
N$90: R64.1 U17.7(CANH)
N$91: U17.1(TXD) U18.4
N$92: R52.1 U17.6(CANL)
N$94: U17.4(RXD) U18.1
N$99: C42.2 IC7.1(C1+)
N$100: C43.2 IC7.4(C2+)
N$101: C42.1 IC7.3(C1-)
N$102: C43.1 IC7.5(C2-)
N$103: C44.1 IC7.2(V+)
N$104: C45.1 IC7.6(V-)
N$266: L6.2 USB_OTG.GND1 USB_OTG.GND2 USB_OTG.GND3 USB_OTG.GND4
N$564: C84.1 L5.1 USB_OTG.VBUS
NRST1: C102.2 R66.1 S1.1
PRTCTL2: U3.14(PRTCTL2) U7.1(ENA) U7.2(FLAG_A)
PRTCTL3: U3.16(PRTCTL3) U7.3(FLAG_B) U7.4(ENB)
R1IN: IC7.13(R1IN) RS1.3
RS232_0_RX: IC7.12(R1OUT) SV6.17
RS232_0_TX: IC7.11(T1IN) SV6.15
RS232_1_RX: IC7.9(R2OUT) SV6.21
RS232_1_TX: IC7.10(T2IN) SV6.19
RS485_EN: SV6.35 U$2.2(/RE) U$2.3(DE)
RS485_RX: SV6.33 U$2.1(RO)
RS485_TX: SV6.31 U$2.4(DI)
SDIO_CK: R20.2 SD1.5(CLK) SV6.20
SDIO_CMD: R8.2 SD1.3(CMD) SV6.22
SDIO_D0: R19.2 SD1.7(DATA0) SV6.12
SDIO_D1: R18.2 SD1.8(DATA1) SV6.14
SDIO_D2: R23.2 SD1.1(DATA2) SV6.16
SDIO_D3: R2.2 SD1.2(CD/DATA3) SV6.18
SIM_CLK: R41.1 U1.32(SIM_CLK)
SIM_IO: C101.2 R45.1 U1.31(SIM_DATA)
SIM_RST: R28.1 U1.33(SIM_RST)
SIM_SW: J3.CD R46.2 U1.34(SIM_PRESENCE)
SIM_VCC: C21.2 J3.C1(VCC) U1.30(SIM_VDD)
T1OUT: IC7.14(T1OUT) RS1.2
USB0-DRV: R80.2 SV6.6 U9.4(EN)
USB0-DRVVBUS: C6.2 R21.1 R82.1 SV6.8
USB_OTG_DM: SV6.9 USB_OTG.D-
USB_OTG_DP: SV6.7 USB_OTG.D+
USB_OTG_ID: SV6.5 USB_OTG.ID
USB_OTG_VBUS2: C98.2 IC1.4(FB) R54.1 R56.1
USB_PWR_A: C36.+ U7.8(OUT_A) USB_HOST3.1
USB_PWR_B: C25.+ U7.5(OUT_B) USB_HOST4.1
VCC [pwr]: FET3.3(D)
Unconnected: IC4.1(Y1) IC4.2(Y0) IC4.3(Z1) IC4.4(Z) IC4.5(Z0) IC4.6(INH) IC4.9(C) IC4.10(B) IC4.11(A) IC4.12(X0) IC4.13(X1) IC4.14(X) IC4.15(Y) SV2.5 SV5.1 SV5.2 SV5.3 SV5.4 SV5.5 SV5.6 SV5.7 SV5.8 SV5.9 SV5.10 SV5.11 SV5.12 SV5.13 SV5.14 SV5.15 SV5.16 SV5.17 SV5.18 SV5.19 SV5.20 SV5.21 SV5.22 SV5.23 SV5.24 SV5.25 SV5.26 SV5.27 SV5.28 SV5.29 SV5.30 SV5.31 SV5.32 SV5.33 SV5.34 SV5.35 SV5.36 SV5.37 SV5.38 SV5.39 SV5.40 SV6.2 SV6.4 SV6.24 SV6.26 SV6.28 SWD1.7 U1.4(RI) U1.5(DCD) U1.6(DSR) U1.7(CTS) U1.8(RTS) U1.11(DISP_CLK) U1.12(DISP_DATA) U1.13(DISP_D/C) U1.14(DISP_CS) U1.15(VDD_EXT) U1.19(MIC_P) U1.20(MIC_N) U1.21(SPK_P) U1.22(SPK_N) U1.23(LINEIN_R) U1.24(LINEIN_L) U1.25(ADC) U1.26(VRTC) U1.27(DBG_TXD) U1.28(DBG_RXD) U1.35(PWM1) U1.36(PWM2) U1.37(SDA) U1.38(SCL) U1.40(GPIO1/KBR4) U1.41(GPIO2/KBR3) U1.42(GPIO3/KBR2) U1.43(GPIO4/KBR1) U1.44(GPIO5/KBR0) U1.47(GPIO6/KBC4) U1.48(GPIO7/KBC3) U1.49(GPIO8/KBC2) U1.50(GPIO9/KBC1) U1.51(GPIO10/KBC0) U1.66(STATUS) U1.67(GPIO11) U1.68(GPIO12) U3.6(NC) U3.7(NC) U3.8(NC) U3.9(NC) U3.13(TEST1) U3.17(NC) U3.18(NC) U3.20(NFDX_LED/GPIO0) U3.23(EECLK) U3.24(EECS) U3.25(EEDO) U3.26(EEDI) U3.31(TDO) U3.35(GPIO3) U3.36(GPIO4) U3.37(GPIO5) U3.42(GPIO6) U3.43(GPIO7) U3.45(CLK24_OUT) U3.47(TEST4) U17.5(VREF) U$10.ADC U$10.CS0 U$10.GPIO4 U$10.GPIO5 U$10.GPIO9 U$10.GPIO10 U$10.GPIO12 U$10.GPIO13 U$10.GPIO14 U$10.GPIO16 U$10.MISO U$10.MOSI U$10.SCLK X1.3 X3.3(GND) X3.4(GND) X3.5(GND) X3.6(GND) X3.7(GND) X3.8(GND) X3.9(GND) X3.10(GND)

## Notes on the sheet
- SIGNAL_0 - RS232_1_TX
  SIGNAL_1 - RS232_2_TX
  SIGNAL_2 - RS232_1_RX
  SIGNAL_3 - RS232_2_RX
  
  POWER - +3V3 - 25mA
- 12 VDC
  3000 mA.
- 5V1 = 1.23*(1+R1/R2)
- DC/DC CONVERTER | reset | POWER GSM | POWER ON | WAN
- RS232
- SIGNAL_0
  POWER VAT +12.0 - 4 AMP
- SIGNAL_0 - BUZZER
  CURRENT - 50mA
- SIGNAL_0 - RS485_TX
  SIGNAL_1 - RS485_RX
  SIGNAL_2 - RS485_EN
  
  POWER - 3V3 - 25mA
- RS485
- SIGNAL_0 - /CARDDETECT
  SIGNAL_1 - SDIO_D0
  SIGNAL_2 - SDIO_D1
  SIGNAL_3 - SDIO_D2
  SIGNAL_4 - SDIO_D3
  SIGNAL_5 - SDIO_CK
  SIGNAL_6 - SDIO_CMD
  
  POWER - +3V3
  CURRENT - 30mA
- 3V0       3V3
- LI-ION_BATTERY
- 4.2V
- Vout=0.6x(1+Re/Rf)
- FERRITE, FIO 24 1A PICO
- RS585
- RTCC BAT | BUZZER
- MICRO SD CARD
- SIGNAL_0 - SCL
  SIGNAL_1 - SCK
  
  POWER - +3V3 - 10 MA
- SIGNAL_0 - CAN_TX
  SIGNAL_0 - CAN_RX
  
  POWER - +3V3 - 25 MA
  POWER - +5.0 - 25 MA
- SIGNAL_0 - JTMS
  SIGNAL_1 - JTCK
  SIGNAL_2 - JTDO
  SIGNAL_3 - JTDI
  SIGNAL_4 - NRTS
  
  POWER - +3V3 - 10MA
- SIGNAL_1 - SIM_RST
  SIGNAL_2 - SIM_CLK
  SIGNAL_3 - SIM_IO
  SIGNAL_4 - SIM_VCC`- 1V8
  SIGNAL_5 - SIM_SW
  
  POWER - +4.0
  CURRENT - 10mA
- CAN 1
  CABO COAXIAL
  VERMELHO - CANH
  BRANCO - CANL
  MALHA - GND
- SWD / JTAG | SIM CARD
- CAN OPEN | EEPROM
- 5.0V | GND
- 3V3 - 1200mA
  5V0 - 2000 mA
- PHY&USB-HOSTx2
- 3.3V | GND
- R0 | R1
- WAN
- R2 | R3
- R4 | R5
- R6 | R7
- G0 | G1
- G2 | G3
- G4 | G5
- G6 | G7
- B0 | B1
- B2 | B3
- B4 | B5
- B6 | B7
- HSYNC | VSYNC
- CLK | DE
- L/R | U/D
- PWRE | BKL
- INT/X1 | RES/X2
- SCL/Y1 | SDA/Y2
- SIGNAL_1 - GSM_RESET
  SIGNAL_2 - PWRKEY
  SIGNAL_3 - GSM_TX
  SIGNAL_4 - GSM_RX
  SIGNAL_5 - GSM_DTR
  
  POWER - +4V1
  
  POWER DOWN - 60 uA
  SLEEP MODE - 1 mA
  STANDY BY - 18 mA
  CALL EGSM900 - 216 mA
  DCS1800 - 146 mA
  PCS1900 - 131 mA
  GPRS - 453 mA
  TX BURST - 2 A
- SIGNAL_0 - USB_OTG_ID
  SIGNAL_1 - USB_OTG_DP
  SIGNAL_2 - USB_OTG_DM
  SIGNAL_3 - USB0-DRVVBUS
  SIGNAL_4 - USB0-DRV
  
  POWER - 5V - 510 MA
- SIGNAL_0 - LAN_RST
  SIGNAL_1 - HOST_USB_DP
  SIGNAL_2 - HOST_USB_DM
  
  POWER - +3V3 - 100 MA
  POWER - +5V0 - 500 MA
- USB-OTG
- GSM / GPR

## Power pins joined to a net without a drawn wire
GND: IC4.8(GND)
VCC: IC4.16(VCC)
VEE: IC4.7(VEE)
VPP: J3.C6(VPP)

## Library data of the parts
100NF1 C2 C5-C15 C17-C19 C21-C24 C26-C28 C30-C33 C35 C37 C38 C41-C46 C49 C53-C58 C65 C66 C81 C82 C84 C91 C96 C98 C101 C102 = rcl:C-EU: CAPACITOR, European symbol
BUZZER = SparkFun:BUZZER: Buzzer 12mm Spark Fun Electronics SKU : Comp-Buzzer
C1 C3 C4 C16 C20 C25 C29 C34 C36 C40 C85 C97 C99 C103 = rcl:CPOL-EU: POLARIZED CAPACITOR, European symbol
D1 = gogo:SCHOTKKY7.62SS
D2 D3 D6 = SparkFun:DIODE: Diode These are standard reverse protection diodes and small signal diodes. SMA package can handle up to about 1A. SOD-323 can handle about 200mA. What the SOD-323 package when ordering, there are some mfgs out there that are 5-pin packages.
D4 = diode:BAT54A: Schottky Diodes Source: Fairchild .. BAT54.pdf
D5 = OLIMEX_DISCRET:SMBJ16A
FET1 FET2 FET4 = endoclear:2N7000: 2N7000 / 2N7002 / NDS7002A N-Channel Enhancement Mode Field Effect Transistor
FET3 = Penko:P-MOS+DIOD
HL1-HL4 = endoclear:M3
IC1 IC2 = national-semiconductor:LM2596: SIMPLE SWITCHER® Power Converter 150 kHz 3A Step-Down Voltage Regulator Source: http://www.national.com/ds/LM/LM2596.pdf; MF: NATIONAL SEMICONDUCTOR; MPN: LM2596S-ADJ/NOPB; OC_FARNELL: 9494367; OC_NEWARK: 41K3842
IC3 = texas:TLC77*: MICROPOWER SUPPLY VOLTAGE SUPERVISORS Source: www.ti.com/.. slvs087l.pdf
IC4 = 40xx:4053: Triple 2-channel ANALOG MULTIPLEXER
IC7 = maxim:MAX3232*: True RS-232 Transceivers 3.0V to 5.5V, Low-Power up to 1Mbps, Using Four 0.1µF External Capacitors Source: http://pdfserv.maxim-ic.com/en/ds/MAX3222-MAX3241.pdf; MPN: MAX3232CSE; OC_FARNELL: 9725490; OC_NEWARK: 90C2890
J2 = ep_molex_6410_7395-02:22-?-02: CONNECTOR wire to board 2.54 mm (.1 inch) pitch header
J3 = SIM7100-6-1-15-00-A_REVC:SIM7100-6-1-15-00-A_REVC: Micro SIM Card Connector - Push-Push Type, 6 Pin, SMT, 1.50mm Profile Check availability <https://pricing.snapeda.com/parts/SIM7100-6-1-15-00-A/Global%20Connector%20Technology/view-part?ref=eda>; AVAILABILITY: In Stock; DESCRIPTION: 7 (6 + 1) Position Card Connector Micro SIM Surface Mount, Right Angle Gold; MF: Global Connector Technology; MP: SIM7100-6-1-15-00-A; PACKAGE: None; PRICE: None; PURCHASE-URL: https://pricing.snapeda.com/search/part/SIM7100-6-1-15-00-A/?ref=eda
J5 J6 = SparkFun-Connectors:CONN_03: Multi connection point. Often used as Generic Header-pin footprint for 0.1 inch spaced/style header connections On any of the 0.1 inch spaced packages, you can populate with these: Break Away Headers - Straight <https://www.sparkfun.com/products/116> (PRT-00116) Break Away Male Headers - Right Angle <https://www.sparkfun.com/products/553> (PRT-00553) Female Headers <https://www.sparkfun.com/products/115> (PRT-00115) Break Away Headers - Machine Pin <https://www.sparkfun.com/products/117> (PRT-00117) Break Away Female Headers - Swiss Machine Pin <https://www.sparkfun.com/products/743> (PRT-00743) Stackable Header - 3 Pin (Female, 0.1") <https://www.sparkfun.com/products/13875> (PRT-13875) For SCREWTERMINALS and SPRING TERMINALS visit here: Screw Terimnals on SparkFun.com <https://www.sparkfun.com/search/results?term=Screw+Terminals> (5mm/3.5mm/2.54mm spacing) This device is also useful as a general connection point to wire up your design to another part of your project. Our various solder wires solder well into these plated through hole pads. Hook-Up Wire - Assortment (Stranded, 22 AWG) <https://www.sparkfun.com/products/11375> (PRT-11375) Hook-Up Wire - Assortment (Solid Core, 22 AWG) <https://www.sparkfun.com/products/11367> (PRT-11367) View the entire wire category on our website here <https://www.sparkfun.com/categories/141> Special notes: Molex polarized connector foot print use with SKU : PRT-08232 with associated crimp pins and housings.; PROD_ID: CONN-13230
JP1 JP3 JP5 JP10 = Renato_casa:JUMPER_3: PIN HEADER
JP2 JP6 JP9 = Renato_casa:JUMPER_2_NO
JP4 = SparkFun-Jumpers:JUMPER-SMT_2_NO: Normally open jumper This jumper has two pads in close proximity to each other. Apply solder to close the connection. Round pads are easier to solder for beginners, but are a lot larger. SparkFun Product that uses the round pads: SparkFun EL Sequencer <https://www.sparkfun.com/products/12781>
L1 L3-L6 L9 L12 = rcl:L-US: INDUCTOR, American symbol
L2 L7 = endoclear:INDUTOR: SDR0805 Series - SMD Power Inductors - BOURNS
L10 = OLIMEX_DISCRET:L
LAN = OLIMEX_CONNECTORS:RJLD-043TC
LED2 = SparkFun:LED: LEDs Standard schematic elements and footprints for 5mm, 3mm, 1206, and 0603 sized LEDs. 5mm - Spark Fun Electronics SKU : COM-00529 (and others)
LIPO_BAT = Penko:CON2
P1-P3 P5 P7 P9-P12 P14-P18 = endoclear:PAD; P: 1
PWR = DOUBLE-SIDE:LED
Q2 = crystal:HC49/S: CRYSTAL
R1-R9 R11-R24 R26-R30 R32-R47 R52 R54-R58 R60-R62 R64 R66 R69-R73 R75 R77 R78 R80 R82 = rcl:R-EU_: RESISTOR, European symbol
RS1 RS2 = ep_molex_6410_7395-02:22-?-03: CONNECTOR wire to board 2.54 mm (.1 inch) pitch header
S1 = SparkFun:SWITCH-MOMENTARY-2
SD1 = con-molex-microsd:MICROSD_SD_MODE: MOLEX - 49225-0821 - CONNECTEUR MICRO SD PUSH/PUSH REV Fabricant: MOLEX Code commande Farnell: 1366700 <http://fr.farnell.com/molex/49225-0821/connecteur-micro-sd-push-push-rev/dp/1366700?Ntt=1366700> Référence fabricant: 49225-0821
SV2 = con-harting-ml:ML10: HARTING
SV5 SV6 = A33-OLinuXino_Rev_C:CON-HARTING-ML_ML40: HARTING
SWD1 = con-lstb:MA05-2: PIN HEADER; OC_FARNELL: unknown; OC_NEWARK: unknown
T3 = transistor:*-NPN-: NPN Transistror BF959 corrected 2008.03.06
U1 = Renato_casa:SMD-GPRS-MODULE-SIM900(LGA68): 317040000; MPN: SIM900
U2 = microchip:24*: Serial EEPROM I2C; MF: MICROCHIP; MPN: 24LC025/SN; OC_FARNELL: unknown; OC_NEWARK: 92C7103
U3 = OLIMEX_IC:LAN9512-JZX
U4 = OLIMEX_IC:SY8008
U7 = OLIMEX_IC:MIC2026: LM3526 Dual Port USB Power Switch and Over-Current Protection Features: -> Compatible with USB1.1 and USB2.0; -> 1 ms fault flag delay filters Hot-Plug events; -> Smooth turn-on eliminates in-rush induced voltage drop; -> UL recognized component: REF#205202; -> 1A nominal shortcircuit output current protects PC power supplies; -> Thermal shutdown protects device in direct short condition; -> 500mA minimum continuous load current; -> Small SO-8 package minimizes board space; -> 2.7V to 5.5V input voltage range; -> 140mOhm Max.switch resistance; -> 1 µA Max. standby current; -> 200µA Max. operating current; -> Under-voltage lockout(UVLO);
U9 = OLIMEX_IC:SY6280
U17 = arm:MCP2551
U18 = Renato_casa:NC7WZ17
U$2 = SparkFun:RS485
U$3-U$5 = SparkFun:TVS
U$10 = esp826612q:ESP12Q: ESP8266 Wifi module 12-Q
USB_HOST3 USB_HOST4 = OLIMEX_CONNECTORS:USB_SHIELD
USB_OTG = OLIMEX_CONNECTORS:MINI_USB9
X1 = con-phoenix-508:MSTBV3: PHOENIX
X2 = adafruit:SMACONNECTOR: SMA Connector 90° DIP SMA Connector, 50 Ohm (4UConnector: 07259)
X3 = ChipDesign_Isola_I-Tera_500um:CHIPDESIGN_GCPW_50_OHM_L: Grounded Coplanar Waveguide Line - left; Relative dielectric constant = 3.45; Thickness of dielectric = 0.5mm.; DIELECTRIC: I-TERA-MT-RF; DK: 3.45; E_EFF: 2.46; PCB_THICKNESS: 0.5MM; ZO: 50 ohms
X15 = Chipdesign_Isola_050:CHIPDESIGN_GCPW_50_OHM_SHUNT_0402: Grounded Coplanar Waveguide Line - shunt cap 0402; Relative dielectric constant = 3.45; Thickness of dielectric = 0.5mm.; DIELECTRIC: I-TERA-MT-RF; DK: 3.45; E_EFF: 2.46; OC_NEWARK: unknown; PCB_THICKNESS: 0.5MM; VALUE: xx pF; ZO: 50 ohms

## Net classes
2 net_ac: width 1.524 mm, drill 0.61 mm
3 motor: width 0.813 mm, drill 0.61 mm, clearance 0.381 mm

## Board
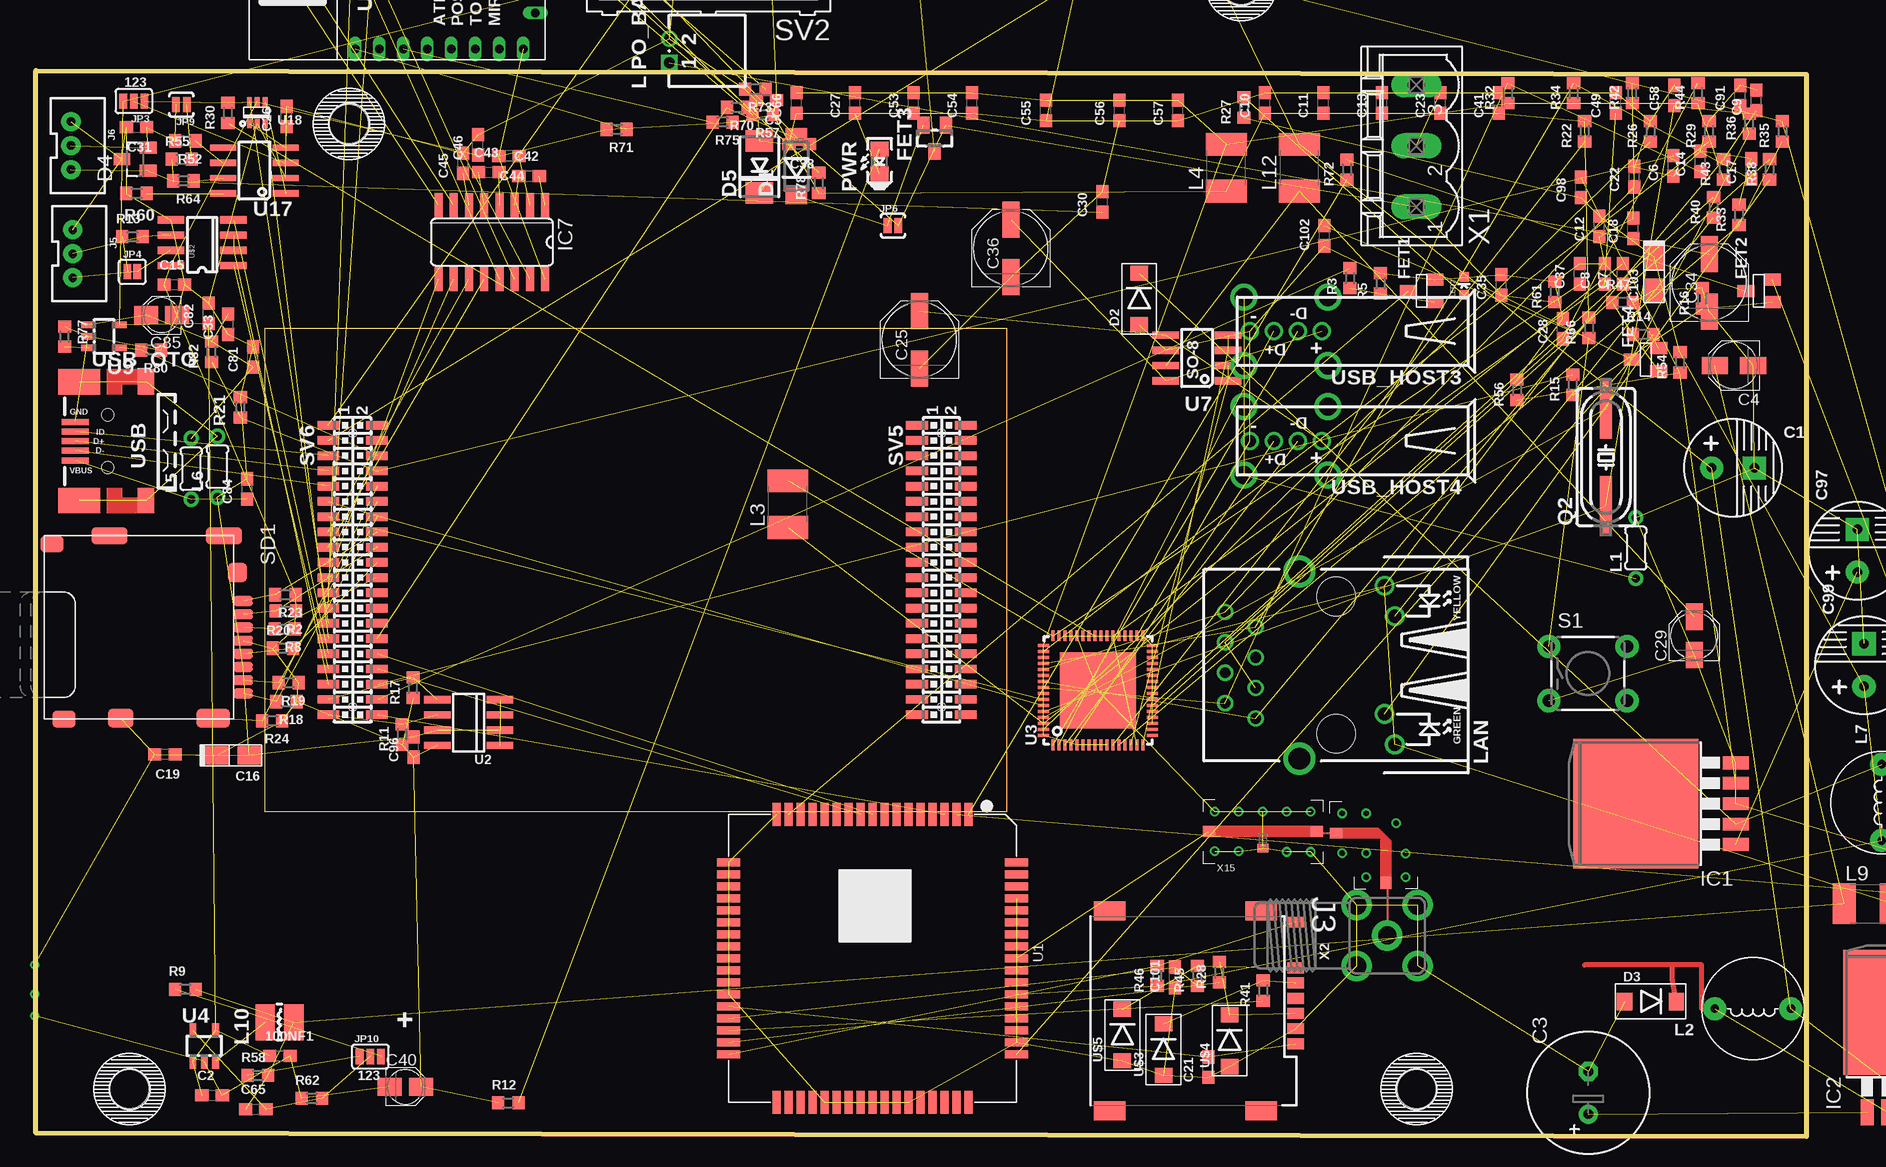
[diagram p5: board, top side]

Size 147.6 x 88.87 mm. Coordinates in mm from the lower left corner, seen from the top.
Outline: 0,88.88 147.6,88.57 147.6,0 0,0.31 0,88.88
Outline: 19.1,27.13 80.98,27.13 80.98,67.36 19.1,67.36 19.1,27.13
Copper layers (1*16): Top 0.018mm / dielectric 1.55mm / Bottom 0.018mm
Design rules "eC_2Layer_PClass6_BaseCopperO18_eCDefault": minimum track width 0.15mm, minimum drill 0.35mm, track to track 0.15mm, track to pad 0.15mm, pad to pad 0.15mm, via to via 0.15mm, smd to smd 0mil, copper to edge 0.25mm, drill to drill 0.35mm, minimum pad ring 0.175mm, minimum via ring 0.125mm, stop-mask expansion 0mil, vias tented up to drill 0.45mm, thermal gap 0.2mm

### Footprints (pad centres in the part's own frame; a part is rotated, then mirrored left to right if it is on the bottom)
C0603 = smd 1.1 x 1: 1 -0.85,0; 2 0.85,0
BUZZER-12MM = drill 0.9: + 3.25,0; - -3.25,0
E3,5-8 = drill 0.8 pad 1.93: + -1.778,0 | drill 0.8 pad 1.93 square: - 1.778,0
E3,5-10 = drill 0.813 pad 1.6: + -1.778,0 | drill 0.813 pad 1.6 octagon: - 1.778,0
PANASONIC_B = smd 2.2 x 1.4: + 1.6,0; - -1.6,0
A/3216-18R = smd 1.95 x 1.5: + 1.375,0; - -1.375,0
PANASONIC_D = smd 3 x 1.4: + 2.4,0; - -2.4,0
PANASONIC_A = smd 2 x 1.5: + 1.3,0; - -1.3,0
MLL-41 = smd 1.45 x 1.8: A 2.445,0; K -2.445,0
SMA-DIODE = smd 1.27 x 1.47: A -2.15,0; C 2.15,0
SOT23 = smd 1 x 1.4: 1 -0.95,-1.1; 2 0.95,-1.1; 3 0,1.1
DO214AA = smd 1.778 x 2.286: A 2.177,0; C -2.177,0
SOT23' = smd 1.4 x 1: 1 1.1,-0.95; 2 1.1,0.95; 3 -1.1,0
M3 = hole 3.2: 0,0
TO263-5 = smd 1.067 x 2.159: 1 -3.404,-5.791; 2 -1.702,-5.791; 3 0,-5.791; 4 1.702,-5.791; 5 3.404,-5.791 | smd 10.8 x 10.41: 6 0,2.54
PW_R-PDSO-G08 = smd 0.4 x 1.2: 1 -0.975,-2.9; 2 -0.325,-2.9; 3 0.325,-2.9; 4 0.975,-2.9; 5 0.975,2.9; 6 0.325,2.9; 7 -0.325,2.9; 8 -0.975,2.9
SO16 = smd 0.66 x 2.032: 1 -4.445,-3.073; 2 -3.175,-3.073; 3 -1.905,-3.073; 4 -0.635,-3.073; 5 0.635,-3.073; 6 1.905,-3.073; 7 3.175,-3.073; 8 4.445,-3.073; 9 4.445,3.073; 10 3.175,3.073; 11 1.905,3.073; 12 0.635,3.073; 13 -0.635,3.073; 14 -1.905,3.073; 15 -3.175,3.073; 16 -4.445,3.073
6410-02 = drill 1.016 long: 1 1.27,0; 2 -1.27,0
GCT_SIM7100-6-1-15-00-A_REVC = smd 1.56 x 2.61: 1 -8.34,5.34; 2 -8.34,-7.29; 3 8.34,-7.29; 4 8.34,5.34 | smd 0.9 x 1.35: C1 2.755,8.215; C2 0.215,8.215; C3 -2.325,8.215; C5 1.485,8.215; C6 -1.055,8.215; C7 -3.595,8.215; CD -7.405,8.215
JST-3-PTH-VERT = drill 0.7 pad 1.6: 1 -2,-0.55; 2 0,-0.55; 3 2,-0.55
JUMPER_3_SMD = smd 0.635 x 1.27: 1 -0.889,0; 2 0,0; 3 0.889,0
JUMPER_2_NO = smd 0.635 x 1.27: 1 -0.45,0; 2 0.45,0
SMT-JUMPER_2_NO_SILK = smd 0.635 x 1.27: 1 -0.406,0; 2 0.406,0
0204/5 = drill 0.7 pad 1.27: 1 -2.54,0; 2 2.54,0
INDUTOR = drill 0.7 pad 1.93: P$1 -3.175,0; P$2 3.175,0
L1812 = smd 1.9 x 3.4: 1 -1.95,0; 2 1.95,0
CD32 = smd 1.6 x 3: 1 -1.2,0; 2 1.2,0
RJLD-043TC_PACK = drill 0.9: 1 -4.455,6.7; 2 -3.185,9.24; 3 -1.915,6.7; 4 -0.645,9.24; 5 0.625,6.7; 6 1.895,9.24; 7 3.165,6.7; 8 4.435,9.24 | drill 1.1: AG -6.61,-4.9; AY 6.61,-4.05; KG -4.07,-4.05; KY 4.07,-4.9 | drill 1.8: HI -7.8,3.05; SHI 7.8,3.05 | hole 3.2: -5.715,0; 5.715,0
LED-0603 = smd 0.8 x 0.8: A 0,-0.75; C 0,0.75
DW02R = drill 0.9 square: 1 -1,0 | drill 0.9: 2 1,0
PAD = drill 0.406: A 0,0
LED-0805 = smd 1.27 x 1.524: A 1.016,0; C -1.016,0
HC49/SMD2_THIN = smd 5 x 1: 1 -4.064,0; 2 4.064,0
R0603 = smd 1 x 1.1: 1 -0.85,0; 2 0.85,0
6410-03 = drill 1.016 long: 1 2.54,0; 2 0,0; 3 -2.54,0
TACTILE-PTH = drill 1.016 pad 1.93: 1 -3.251,2.261; 2 3.251,2.261; 3 -3.251,-2.261; 4 3.251,-2.261
MICRO_SD_CONNECTOR = smd 0.8 x 1.6: 1 -2.03,8.2; 2 -0.93,8.2; 3 0.17,8.2; 4 1.27,8.2; 5 2.37,8.2; 6 3.47,8.2; 7 4.57,8.2; 8 5.67,8.2 | smd 1.55 x 2.8: 9 7.735,5.7 | smd 1.55 x 2.1: 10 7.735,-2 | smd 1.4 x 1.9: 11 7.81,-6.75; 12 -6.79,-7.75 | smd 1.4 x 3: 13 -7.49,-2.95; 14 -7.49,6.6 | smd 1.6 x 1.55: 15 -4.43,7.725
ML10 = drill 0.914 octagon: 1 -5.08,-1.27; 2 -5.08,1.27; 3 -2.54,-1.27; 4 -2.54,1.27; 5 0,-1.27; 6 0,1.27; 7 2.54,-1.27; 8 2.54,1.27; 9 5.08,-1.27; 10 5.08,1.27
CON-HARTING-ML_PA-V16X-2X20-LF_0.65_DRILL = smd 0.7 x 1.8: 1 -12.065,-2.032; 2 -12.065,2.032; 3 -10.795,-2.032; 4 -10.795,2.032; 5 -9.525,-2.032; 6 -9.525,2.032; 7 -8.255,-2.032; 8 -8.255,2.032; 9 -6.985,-2.032; 10 -6.985,2.032; 11 -5.715,-2.032; 12 -5.715,2.032; 13 -4.445,-2.032; 14 -4.445,2.032; 15 -3.175,-2.032; 16 -3.175,2.032; 17 -1.905,-2.032; 18 -1.905,2.032; 19 -0.635,-2.032; 20 -0.635,2.032; 21 0.635,-2.032; 22 0.635,2.032; 23 1.905,-2.032; 24 1.905,2.032; 25 3.175,-2.032; 26 3.175,2.032; 27 4.445,-2.032; 28 4.445,2.032; 29 5.715,-2.032; 30 5.715,2.032; 31 6.985,-2.032; 32 6.985,2.032; 33 8.255,-2.032; 34 8.255,2.032; 35 9.525,-2.032; 36 9.525,2.032; 37 10.795,-2.032; 38 10.795,2.032; 39 12.065,-2.032; 40 12.065,2.032 | hole 0.65: -11.43,0; 11.43,0
MA05-2 = drill 1.016 octagon: 1 -5.08,-1.27; 2 -5.08,1.27; 3 -2.54,-1.27; 4 -2.54,1.27; 5 0,-1.27; 6 0,1.27; 7 2.54,-1.27; 8 2.54,1.27; 9 5.08,-1.27; 10 5.08,1.27
SOT23-BEC = smd 1 x 1.4: B -0.95,-1.1; C 0,1.1; E 0.95,-1.1
LGA68-1.0-24.0X24.0X3.0MM = smd 1.93 x 0.66: 1 -12,8; 2 -12,7; 3 -12,6; 4 -12,5; 5 -12,4; 6 -12,3; 7 -12,2; 8 -12,1; 9 -12,0; 10 -12,-1; 11 -12,-2; 12 -12,-3; 13 -12,-4; 14 -12,-5; 15 -12,-6; 16 -12,-7; 17 -12,-8; 35 12,-8; 36 12,-7; 37 12,-6; 38 12,-5; 39 12,-4; 40 12,-3; 41 12,-2; 42 12,-1; 43 12,0; 44 12,1; 45 12,2; 46 12,3; 47 12,4; 48 12,5; 49 12,6; 50 12,7; 51 12,8 | smd 0.66 x 1.93: 18 -8,-12; 19 -7,-12; 20 -6,-12; 21 -5,-12; 22 -4,-12; 23 -3,-12; 24 -2,-12; 25 -1,-12; 26 0,-12; 27 1,-12; 28 2,-12; 29 3,-12; 30 4,-12; 31 5,-12; 32 6,-12; 33 7,-12; 34 8,-12; 52 8,12; 53 7,12; 54 6,12; 55 5,12; 56 4,12; 57 3,12; 58 2,12; 59 1,12; 60 0,12; 61 -1,12; 62 -2,12; 63 -3,12; 64 -4,12; 65 -5,12; 66 -6,12; 67 -7,12; 68 -8,12
SO-08 = smd 0.6 x 2.2: 1 -1.905,-2.6; 2 -0.635,-2.6; 3 0.635,-2.6; 4 1.905,-2.6; 5 1.905,2.6; 6 0.635,2.6; 7 -0.635,2.6; 8 -1.905,2.6
QFN64 = smd 0.9 x 0.25: 1 -4.55,3.75; 2 -4.55,3.25; 3 -4.55,2.75; 4 -4.55,2.25; 5 -4.55,1.75; 6 -4.55,1.25; 7 -4.55,0.75; 8 -4.55,0.25; 9 -4.55,-0.25; 10 -4.55,-0.75; 11 -4.55,-1.25; 12 -4.55,-1.75; 13 -4.55,-2.25; 14 -4.55,-2.75; 15 -4.55,-3.25; 16 -4.55,-3.75; 33 4.55,-3.75; 34 4.55,-3.25; 35 4.55,-2.75; 36 4.55,-2.25; 37 4.55,-1.75; 38 4.55,-1.25; 39 4.55,-0.75; 40 4.55,-0.25; 41 4.55,0.25; 42 4.55,0.75; 43 4.55,1.25; 44 4.55,1.75; 45 4.55,2.25; 46 4.55,2.75; 47 4.55,3.25; 48 4.55,3.75 | smd 0.25 x 0.9: 17 -3.75,-4.55; 18 -3.25,-4.55; 19 -2.75,-4.55; 20 -2.25,-4.55; 21 -1.75,-4.55; 22 -1.25,-4.55; 23 -0.75,-4.55; 24 -0.25,-4.55; 25 0.25,-4.55; 26 0.75,-4.55; 27 1.25,-4.55; 28 1.75,-4.55; 29 2.25,-4.55; 30 2.75,-4.55; 31 3.25,-4.55; 32 3.75,-4.55; 49 3.75,4.55; 50 3.25,4.55; 51 2.75,4.55; 52 2.25,4.55; 53 1.75,4.55; 54 1.25,4.55; 55 0.75,4.55; 56 0.25,4.55; 57 -0.25,4.55; 58 -0.75,4.55; 59 -1.25,4.55; 60 -1.75,4.55; 61 -2.25,4.55; 62 -2.75,4.55; 63 -3.25,4.55; 64 -3.75,4.55 | smd 6.35 x 6.35: 65 0,0
SOT23-5@2 = smd 0.55 x 1.2: 1 -0.95,-1.3; 2 0,-1.3; 3 0.95,-1.3; 4 0.95,1.3; 5 -0.95,1.3
SO-8 = smd 0.6 x 2.2: 1 -1.905,-2.6; 2 -0.635,-2.6; 3 0.635,-2.6; 4 1.905,-2.6; 5 1.905,2.6; 6 0.635,2.6; 7 -0.635,2.6; 8 -1.905,2.6
SOT23-5 = smd 1.2 x 0.55: 1 1.3,-0.95; 2 1.3,0; 3 1.3,0.95; 4 -1.3,0.95; 5 -1.3,-0.95
SO-08_THIN = smd 0.508 x 2.159: 1 -1.905,-2.603; 2 -0.635,-2.603; 3 0.635,-2.603; 4 1.905,-2.603; 5 1.905,2.603; 6 0.635,2.603; 7 -0.635,2.603; 8 -1.905,2.603
SC70-6 = smd 0.4 x 0.75: 1 -0.65,-0.925; 2 0,-0.925; 3 0.65,-0.925; 4 0.65,0.925; 5 0,0.925; 6 -0.65,0.925
SO08 = smd 0.61 x 2.21: 1 -1.905,-2.616; 2 -0.635,-2.616; 3 0.635,-2.616; 4 1.905,-2.616; 5 1.905,2.616; 6 0.635,2.616; 7 -0.635,2.616; 8 -1.905,2.616
ESP8266F = drill 0.7 long: ADC -7,5; CS0 -4,-8; EN -7,3; GND 9,-7; GPIO0 9,-1; GPIO2 9,-3; GPIO4 9,1; GPIO5 9,3; GPIO9 0,-8; GPIO10 2,-8; GPIO12 -7,-3; GPIO13 -7,-5; GPIO14 -7,-1; GPIO15 9,-5; GPIO16 -7,1; MISO -2,-8; MOSI 4,-8; RST -7,7; RX 9,5; SCLK 6,-8; TX 9,7; VCC -7,-7
USB_A_VERTICAL_PTH = drill 1: 1 3.45,12.75; 2 3.45,14.75; 3 3.45,16.75; 4 3.45,18.75 | drill 1.5: P$1 0.6,12.25; P$2 6.3,12.25; P$3 6.3,19.25; P$4 0.6,19.25
USB_MINI_9PIN-SD = smd 2.25 x 0.5: D+ -3.722,0; D- -3.722,-0.8; GND -3.722,1.6; ID -3.722,0.8; VBUS -3.722,-1.6 | smd 1.4 x 2.1: GND1 2.184,-4.95; GND3 2.184,4.95 | smd 3.5 x 2.1: GND2 -3.366,-4.95; GND4 -3.366,4.95 | hole 1: -1.016,-2.2; -1.016,2.2
MSTBV3 = drill 1.397 long: 1 -5.08,0; 2 0,0; 3 5.08,0
SMA90_DIP = drill 1.5 pad 2.54: ANTENNA 0,0 | drill 1.6 pad 2.54: GND1 -2.54,2.54; GND2 2.54,2.54; GND3 -2.54,-2.54; GND4 2.54,-2.54
GCPW_50_OHM_LEFT = smd 0.9 x 1: 1 4.15,-4.15 | smd 1 x 0.9: 2 0,0 | drill 0.45: 3 2.5,-3.65; 4 2.5,-1.65; 5 0.5,-1.65; 6 0.5,1.65; 7 2.5,1.65; 8 5,0.85; 9 5.8,-1.7; 10 5.8,-3.65
GCPW_50_OHM_0402_SHUNT = smd 1 x 0.9: 1 -4.5,0.75; 2 4.5,0.75 | drill 0.45: 3 -4,2.4; 4 -2,2.4; 5 0,2.4; 6 2,2.4; 7 4,2.4; 8 -4,-0.9; 9 -2,-0.9; 11 2,-0.95; 12 4,-0.95 | smd 0.9 x 0.7: 10 0,-0.65

### Placement (x,y rotation side)
100NF1  20.35,6.73 0 top
BUZZER  86.61,103 90 top  (outside the outline)
C1  141.48,55.75 0 top
C2  14.71,3.45 0 top
C3  129.41,3.66 90 top
C4  141.55,64.29 180 top
C5  60.91,86.41 180 top
C6  136.5,80.92 90 top
C7  132.28,71.93 90 top
C8  130.81,71.93 90 top
C9  143.43,86.39 90 top
C10  102.44,86.18 90 top
C11  107.32,86.18 90 top
C12  130.33,75.9 90 top
C13  112.19,86.18 90 top
C14  138.76,81.31 90 top
C15  11.56,71.02 0 top
C16  16.43,31.78 180 top
C17  143,80.67 90 top
C18  133.15,75.72 90 top
C19  10.77,31.88 180 top
C20  39.73,109.85 90 top  (outside the outline)
C21  97.74,5.79 90 top
C22  133.25,80.04 90 top
C23  117.07,86.18 90 top
C24  163.4,-1.63 0 top  (outside the outline)
C25  73.66,66.45 90 top
C26  20.9,85.04 90 top
C27  68.3,86.18 90 top
C28  127.28,67.36 90 top
C29  138.25,41.76 90 top
C30  88.9,77.93 90 top
C31  8.41,84.15 180 top
C32  163.55,-6.5 0 top  (outside the outline)
C33  16.03,67.72 90 top
C34  139.5,71.2 90 top
C35  122.17,71.02 90 top
C36  81.28,74.07 90 top
C37  128.7,71.93 90 top
C38  63.65,82.75 180 top
C40  30.81,4.17 0 top
C41  121.95,86.18 90 top
C42  41.12,80.09 0 top
C43  37.77,80.39 0 top
C44  39.45,81.76 180 top
C45  35.64,81.15 90 top
C46  36.86,82.68 90 top
C49  131.7,86.18 90 top
C53  73.18,86.18 90 top
C54  78.05,86.18 90 top
C55  84.2,85.55 90 top
C56  90.35,85.55 90 top
C57  95.23,85.55 90 top
C58  136.58,86.79 90 top
C65  18.34,2.29 0 top
C66  63.42,86.18 90 top
C81  18.11,65 90 top
C82  14.4,68.63 90 top
C84  17.63,54 90 top
C85  10.49,68.48 180 top
C91  142.06,86.79 90 top
C96  31.5,32.49 90 top
C97  151.84,48.84 90 top  (outside the outline)
C98  128.8,79.15 90 top
C99  152.4,39.32 90 top  (outside the outline)
C101  94.95,13.28 90 top
C102  107.42,75.11 90 top
C103  134.9,71.93 90 top
D1  63.4,80.9 90 top
D2  91.97,69.85 90 top
D3  134.6,11.28 0 top
D4  8.28,81.48 90 top
D5  60.33,80.85 90 top
D6  94.67,102.41 90 top  (outside the outline)
FET1  115.52,70.51 90 top
FET2  143.64,70.51 90 top
FET3  IRLML6402  [SOT23']  74.93,83.24 90 top
FET4  134.19,64.8 90 top
HL1  7.82,3.96 0 top
HL2  26.11,84.43 0 top
HL3  115.09,3.96 0 top
HL4  100.48,96.01 0 top  (outside the outline)
IC1  135.92,27.76 90 top
IC2  156.06,7.82 0 top  (outside the outline)
IC3  159.84,25.43 0 top  (outside the outline)
IC4  76.35,111.51 0 top  (outside the outline)
IC7  38.02,74.57 180 top
J2  32.41,111.23 90 top  (outside the outline)
J3  96.8,10.49 270 top
J5  3.63,73.61 270 top
J6  3.48,82.63 270 top
JP1  166.73,9.47 0 top  (outside the outline)
JP2  64.29,106.93 90 top  (outside the outline)
JP3  8.18,86.33 180 top
JP4  8.05,72.11 0 top
JP5  164.69,19.43 0 top  (outside the outline)
JP6  71.45,75.95 0 top
JP9  12.14,86.03 180 top
JP10  27.89,6.68 0 top
L1  133.38,49.07 90 top
L2  143.13,10.67 180 top
L3  62.69,52.73 90 top
L4  99.24,80.77 90 top
L5  12.95,55.68 90 top
L6  15.14,55.85 90 top
L7  153.87,27.86 90 top  (outside the outline)
L9  152.71,19.43 0 top  (outside the outline)
L10  20.32,9.55 0 top
L12  105.33,80.77 90 top
LAN  108.38,39.32 90 top
LED2  119.05,70.92 0 top
LIPO_BAT  52.81,90.53 90 top
P1  -0.1,10.06 90 top
P2  -0.1,11.89 90 top
P3  -0.1,14.33 90 top
P5  35.87,102.11 180 top  (outside the outline)
P7  33.43,102.11 180 top  (outside the outline)
P9  31.6,102.11 180 top  (outside the outline)
P10  29.16,102.11 180 top  (outside the outline)
P11  27.33,102.11 180 top  (outside the outline)
P12  24.89,102.11 180 top  (outside the outline)
P14  23.06,102.11 180 top  (outside the outline)
P15  20.63,102.11 180 top  (outside the outline)
P16  40.74,102.11 90 top  (outside the outline)
P17  40.74,102.72 90 top  (outside the outline)
P18  38.91,102.11 180 top  (outside the outline)
PWR  70.33,81.31 90 top
Q2  130.89,56.64 90 top
R1  56.29,107.04 90 top  (outside the outline)
R2  20.85,43.81 180 top
R3  109.55,71.58 90 top
R4  59.72,107.19 90 top  (outside the outline)
R5  112.09,71.15 90 top
R6  57.96,107.01 90 top  (outside the outline)
R7  54.66,106.58 90 top  (outside the outline)
R8  20.75,42.32 180 top
R9  12.47,12.29 0 top
R11  30.53,33.53 90 top
R12  39.4,2.82 0 top
R13  8.08,75.03 0 top
R14  133.99,66.88 0 top
R15  128.12,62.69 90 top
R16  138.91,69.88 90 top
R17  31.45,37.41 90 top
R18  20.9,36.27 180 top
R19  21.08,37.85 180 top
R20  20.6,40.72 0 top
R21  17.07,60.81 90 top
R22  129.11,83.82 90 top
R23  20.83,45.19 180 top
R24  19.71,34.67 180 top
R26  134.6,83.82 90 top
R27  100.71,85.8 90 top
R28  98.65,13.72 90 top
R29  139.47,83.82 90 top
R30  16.03,85.34 90 top
R32  122.71,86.99 90 top
R33  141.99,76.83 90 top
R34  128.19,86.99 90 top
R35  145.59,83.82 90 top
R36  142.82,84.45 90 top
R37  88.98,96.82 90 top  (outside the outline)
R38  144.53,80.64 90 top
R39  87.07,96.95 90 top  (outside the outline)
R40  139.85,77.47 90 top
R41  102.31,12.19 90 top
R42  133.07,86.99 90 top
R43  140.69,80.64 90 top
R44  138.56,86.99 90 top
R45  96.83,13.41 90 top
R46  93.47,13.41 90 top
R47  132.28,69.55 0 top
R52  12.47,83.01 180 top
R54  137.06,64.54 90 top
R55  12.17,81.48 0 top
R56  123.47,62.26 90 top
R57  60.6,85.19 180 top
R58  18.52,5.11 0 top
R60  8.41,78.64 180 top
R61  126.62,70.43 90 top
R62  23.01,3.2 0 top
R64  12.32,79.68 180 top
R66  129.46,67.44 90 top
R69  61.6,106.86 90 top  (outside the outline)
R70  58.47,85.8 180 top
R71  48.41,83.97 180 top
R72  109.3,80.62 90 top
R73  60,87.33 180 top
R75  57.25,84.58 180 top
R77  2.41,66.7 270 top
R78  65.28,79.5 90 top
R80  9.63,65.58 180 top
R82  14.66,65.43 90 top
RS1  23.06,108.81 90 top  (outside the outline)
RS2  14.63,109.02 90 top  (outside the outline)
S1  129.39,38.61 0 top
SD1  9.09,42.62 270 top
SV2  56.08,98.25 180 top  (outside the outline)
SV5  75.49,47.24 270 top
SV6  26.42,47.24 270 top
SWD1  58.37,111.46 180 top  (outside the outline)
T3  92.43,97.16 90 top  (outside the outline)
U1  69.75,14.86 270 top
U2  36.09,34.52 90 top
U3  88.54,37.21 90 top
U4  14.05,7.57 0 top
U7  96.8,64.92 90 top
U9  5.69,66.73 180 top
U17  18.24,80.54 90 top
U18  18.47,85.37 0 top
U$2  13.87,74.52 90 top
U$3  94.01,7.26 90 top
U$4  99.52,8 90 top
U$5  90.58,8.48 90 top
U$10  33.63,97.69 90 top
USB_HOST3  119.96,63.7 90 top
USB_HOST4  119.96,54.56 90 top
USB_OTG  7.01,57.99 0 top
X1  115.09,82.6 90 top
X2  112.65,16.76 90 top
X3  108.38,25.3 0 top
X15  102.29,24.69 0 top

### Tracks (layer width: path | path; a pad name or v marks a point on that pad's centre or on a via)
+3V3  (60 unrouted)
+4.1V  (10 unrouted)
+5V  (13 unrouted)
  Top 0.406: C1.+ 139.65,55.75
+12V  (1 unrouted)
+24V  (2 unrouted)
/CARDDETECT  (2 unrouted)
/NRST  (5 unrouted)
AXP_POWERON  (2 unrouted)
BUZZER  (1 unrouted)
CAN_RX  (1 unrouted)
CAN_TX  (1 unrouted)
CANH  (4 unrouted)
CANH2  (2 unrouted)
ESP8266_RX  (1 unrouted)
ESP8266_TX  (1 unrouted)
GND  (176 unrouted)
GSM_DTR  (1 unrouted)
GSM_PWRKEY  (1 unrouted)
GSM_RESET  (1 unrouted)
GSM_RX  (1 unrouted)
GSM_TX  (1 unrouted)
HOST_USB_DM  (1 unrouted)
HOST_USB_DP  (1 unrouted)
I2C_SCL  (2 unrouted)
I2C_SDA  (2 unrouted)
JTCK  (2 unrouted)
JTDI  (2 unrouted)
JTDO  (2 unrouted)
JTMS  (2 unrouted)
N$1  (1 unrouted)
N$2  (1 unrouted)
N$3  (2 unrouted)
N$4  (1 unrouted)
N$5  (2 unrouted)
N$6  (1 unrouted)
N$7  (1 unrouted)
N$8  (2 unrouted)
N$9  (4 unrouted)
N$10  (1 unrouted)
N$11  (1 unrouted)
N$12  (1 unrouted)
N$13  (2 unrouted)
N$14  (2 unrouted)
N$15  (1 unrouted)
N$16  (2 unrouted)
N$17  (1 unrouted)
N$18  (2 unrouted)
N$19  (1 unrouted)
N$20  (1 unrouted)
N$21  (4 unrouted)
N$22  (1 unrouted)
N$23  (1 unrouted)
N$24  (1 unrouted)
N$25  (1 unrouted)
N$26  (1 unrouted)
N$27  (1 unrouted)
N$28  (2 unrouted)
N$29  (1 unrouted)
N$30  (2 unrouted)
N$31
  Top 0.15: X3.2 106.55,25.3 X15.2
N$32  (7 unrouted)
N$33  (2 unrouted)
N$35  (1 unrouted)
N$36  (2 unrouted)
N$37  (2 unrouted)
N$38  (1 unrouted)
N$39  (3 unrouted)
N$40  (2 unrouted)
N$41  (1 unrouted)
N$42  (1 unrouted)
N$43  (1 unrouted)
N$44  (1 unrouted)
N$45  (3 unrouted)
N$46  (3 unrouted)
N$47  (1 unrouted)
N$48  (1 unrouted)
N$49  (1 unrouted)
N$50  (1 unrouted)
N$51  (1 unrouted)
N$52  (3 unrouted)
N$53  (1 unrouted)
N$54  (3 unrouted)
N$55  (3 unrouted)
N$56  (3 unrouted)
N$57  (1 unrouted)
N$58  (3 unrouted)
N$59  (1 unrouted)
N$60  (1 unrouted)
N$61  (1 unrouted)
N$62  (1 unrouted)
N$63
  Top 0.15: X3.1 112.65,21.03 X2.ANTENNA
N$64  (2 unrouted)
N$65  (3 unrouted)
N$66  (1 unrouted)
N$67  (1 unrouted)
N$68  (5 unrouted)
N$69  (1 unrouted)
N$70  (1 unrouted)
  Top 0.406: 136.42,14.33 138.86,14.33 138.86,10.67 L2.P$2 | 136.42,14.33 129.11,14.33 | D3.C 136.42,13.11 136.42,14.33
N$71  (1 unrouted)
N$75  (1 unrouted)
N$77  (19 unrouted)
N$78  (1 unrouted)
N$81  (5 unrouted)
N$84  (2 unrouted)
N$85  (2 unrouted)
N$90  (1 unrouted)
N$91  (1 unrouted)
N$92  (1 unrouted)
N$94  (1 unrouted)
N$99  (1 unrouted)
N$100  (1 unrouted)
N$101  (1 unrouted)
N$102  (1 unrouted)
N$103  (1 unrouted)
N$104  (1 unrouted)
N$266  (4 unrouted)
N$564  (2 unrouted)
NRST1  (2 unrouted)
PRTCTL2  (2 unrouted)
PRTCTL3  (2 unrouted)
R1IN  (1 unrouted)
RS232_0_RX  (1 unrouted)
RS232_0_TX  (1 unrouted)
RS232_1_RX  (1 unrouted)
RS232_1_TX  (1 unrouted)
RS485_EN  (2 unrouted)
RS485_RX  (1 unrouted)
RS485_TX  (1 unrouted)
SDIO_CK  (2 unrouted)
SDIO_CMD  (2 unrouted)
SDIO_D0  (2 unrouted)
SDIO_D1  (2 unrouted)
SDIO_D2  (2 unrouted)
SDIO_D3  (2 unrouted)
SIM_CLK  (1 unrouted)
SIM_IO  (2 unrouted)
SIM_RST  (1 unrouted)
SIM_SW  (2 unrouted)
SIM_VCC  (2 unrouted)
T1OUT  (1 unrouted)
USB0-DRV  (2 unrouted)
USB0-DRVVBUS  (3 unrouted)
USB_OTG_DM  (1 unrouted)
USB_OTG_DP  (1 unrouted)
USB_OTG_ID  (1 unrouted)
USB_OTG_VBUS2  (3 unrouted)
USB_PWR_A  (2 unrouted)
USB_PWR_B  (2 unrouted)
VCC  (1 unrouted)

### Text on the board
tPlace: +